# Altium project DC2019_Main_PCB.PrjPCB (part 1 of 2)
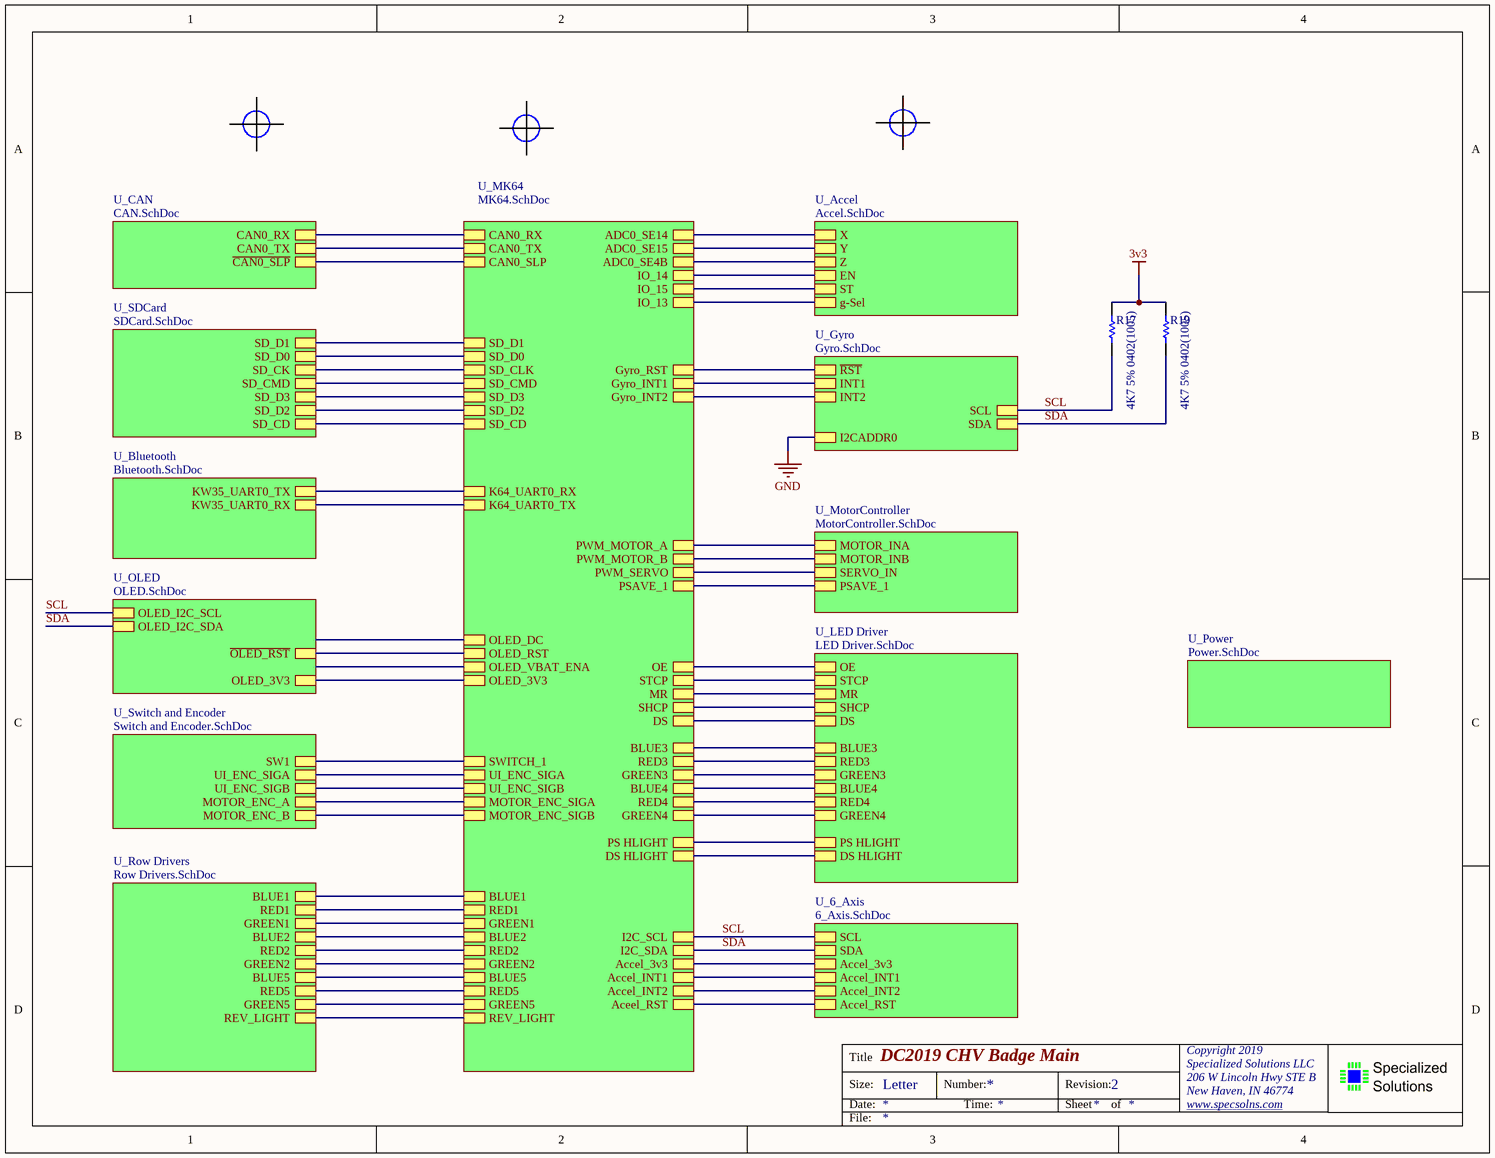
[diagram p0: Main.SchDoc]
projecttitle: DC2019 CHV Badge Main; projectrevision: 2
19 sheets, 179 parts. Net scope: hierarchical (ports join the sheet entries above them; power ports are global).
Board file: Main PCB.PcbDoc
Sheets:
  Main.SchDoc
    U_Gyro = Gyro.SchDoc
    U_MotorController = MotorController.SchDoc
    U_OLED = OLED.SchDoc
    U_SDCard = SDCard.SchDoc
    U_CAN = CAN.SchDoc
    U_Bluetooth = Bluetooth.SchDoc
    U_LED Driver = LED Driver.SchDoc
      595andMun = 595andMun.SchDoc
      U_20p Connector = 20p Connector.SchDoc
      U_Main Board RGB = Main Board RGB.SchDoc
        RGB and TurnS = RGB and TurnS.SchDoc
        RGB and TurnS = RGB and TurnS.SchDoc
    U_MK64 = MK64.SchDoc
      U_MK64 Power ADC = MK64 Power ADC.SchDoc
    U_Accel = Accel.SchDoc
    U_Switch and Encoder = Switch and Encoder.SchDoc
    U_Power = Power.SchDoc
    U_Row Drivers = Row Drivers.SchDoc
    U_6_Axis = 6_Axis.SchDoc

## Sheet Main.SchDoc
size Letter

### Parts
(Parts that share a designator on the sheet are numbered #1, #2 ... from top to bottom, then left to right.)
?#1  Fiducial (Cross)  [Fiducial - Cross]  (value not drawn)  (no BOM)
?#2  Fiducial (Cross)  [Fiducial - Cross]  (value not drawn)  (no BOM)
?#3  Fiducial (Cross)  [Fiducial - Cross]  (value not drawn)  (no BOM)
R17  4K7 5% 0402(1005)  [RESC0402(1005)_L]
R19  4K7 5% 0402(1005)  [RESC0402(1005)_L]

### Sub-sheets
U_6_Axis = 6_Axis.SchDoc: Accel_3v3, SCL, SDA, Accel_INT1, Accel_INT2, Accel_RST
U_Accel = Accel.SchDoc: g-Sel, X, Y, Z, EN, ST
U_Bluetooth = Bluetooth.SchDoc: KW35_UART0_RX, KW35_UART0_TX
U_CAN = CAN.SchDoc: ~{CAN0_SLP}, CAN0_TX, CAN0_RX
U_Gyro = Gyro.SchDoc: ~{RST}, INT1, INT2, SCL, SDA, I2CADDR0
U_LED Driver = LED Driver.SchDoc: OE, STCP, MR, SHCP, DS, BLUE3, RED3, GREEN3, BLUE4, RED4, GREEN4, PS HLIGHT, DS HLIGHT
U_MK64 = MK64.SchDoc: CAN0_RX, CAN0_TX, CAN0_SLP, SD_D1, SD_D0, SD_CLK, SD_CMD, SD_D3, SD_D2, SD_CD, OLED_RST, OLED_DC, OLED_VBAT_ENA, OLED_3V3, I2C_SDA, I2C_SCL, Gyro_RST, Gyro_INT1, Gyro_INT2, PWM_MOTOR_A, PWM_MOTOR_B, PWM_SERVO, UI_ENC_SIGA, UI_ENC_SIGB, MOTOR_ENC_SIGA, MOTOR_ENC_SIGB, IO_13, IO_15, IO_14, OE, STCP, MR, SHCP, DS, RED1, GREEN1, BLUE1, BLUE3, RED2, BLUE2, GREEN3, RED3, GREEN2, GREEN4, RED4, BLUE4, PSAVE_1, SWITCH_1, PS HLIGHT, DS HLIGHT, K64_UART0_TX, K64_UART0_RX, ADC0_SE14, ADC0_SE15, ADC0_SE4B, BLUE5, RED5, GREEN5, REV_LIGHT, Aceel_RST, Accel_INT2, Accel_3v3, Accel_INT1
U_MotorController = MotorController.SchDoc: MOTOR_INA, MOTOR_INB, SERVO_IN, PSAVE_1
U_OLED = OLED.SchDoc: OLED_I2C_SCL, OLED_I2C_SDA, ~{OLED_RST}, OLED_3V3
U_Power = Power.SchDoc: no entries
U_Row Drivers = Row Drivers.SchDoc: BLUE1, RED1, GREEN1, BLUE2, RED2, GREEN2, REV_LIGHT, RED5, BLUE5, GREEN5
U_SDCard = SDCard.SchDoc: SD_D2, SD_D3, SD_CK, SD_D1, SD_D0, SD_CMD, SD_CD
U_Switch and Encoder = Switch and Encoder.SchDoc: UI_ENC_SIGA, UI_ENC_SIGB, MOTOR_ENC_A, MOTOR_ENC_B, SW1

### Nets
3v3: R17.2 R19.2
Accel_3v3: sheet U_MK64/Accel_3v3, sheet U_6_Axis/Accel_3v3
INT1: sheet U_MK64/Accel_INT1, sheet U_6_Axis/Accel_INT1
INT2: sheet U_MK64/Accel_INT2, sheet U_6_Axis/Accel_INT2
OLED_3V3: sheet U_OLED/OLED_3V3, sheet U_MK64/OLED_3V3
RST: sheet U_MK64/Aceel_RST, sheet U_6_Axis/Accel_RST
SCL: R17.1 ; sheet U_Gyro/SCL, sheet U_OLED/OLED_I2C_SCL, sheet U_MK64/I2C_SCL, sheet U_6_Axis/SCL
SDA: R19.1 ; sheet U_Gyro/SDA, sheet U_OLED/OLED_I2C_SDA, sheet U_MK64/I2C_SDA, sheet U_6_Axis/SDA
SW1: sheet U_MK64/SWITCH_1, sheet U_Switch and Encoder/SW1
UI_ENC_SIGA: sheet U_MK64/UI_ENC_SIGA, sheet U_Switch and Encoder/UI_ENC_SIGA
UI_ENC_SIGB: sheet U_MK64/UI_ENC_SIGB, sheet U_Switch and Encoder/UI_ENC_SIGB
NetC3_2: sheet U_MK64/ADC0_SE15, sheet U_Accel/Y
NetC4_2: sheet U_MK64/ADC0_SE14, sheet U_Accel/X
NetC5_2: sheet U_MK64/ADC0_SE4B, sheet U_Accel/Z
NetP7_1: sheet U_SDCard/SD_D2, sheet U_MK64/SD_D2
NetP7_2: sheet U_SDCard/SD_D3, sheet U_MK64/SD_D3
NetP7_3: sheet U_SDCard/SD_CMD, sheet U_MK64/SD_CMD
NetP7_7: sheet U_SDCard/SD_D0, sheet U_MK64/SD_D0
NetP7_8: sheet U_SDCard/SD_D1, sheet U_MK64/SD_D1
NetP7_9: sheet U_SDCard/SD_CD, sheet U_MK64/SD_CD
NetQ2_2: sheet U_MK64/RED1, sheet U_Row Drivers/RED1
NetQ2_5: sheet U_MK64/BLUE1, sheet U_Row Drivers/BLUE1
NetQ3_2: sheet U_LED Driver/RED4, sheet U_MK64/RED4
NetQ3_5: sheet U_LED Driver/BLUE4, sheet U_MK64/BLUE4
NetQ4_2: sheet U_MK64/RED5, sheet U_Row Drivers/RED5
NetQ4_5: sheet U_MK64/GREEN1, sheet U_Row Drivers/GREEN1
NetQ5_2: sheet U_LED Driver/DS HLIGHT, sheet U_MK64/DS HLIGHT
NetQ5_5: sheet U_LED Driver/GREEN4, sheet U_MK64/GREEN4
NetQ10_2: sheet U_MK64/REV_LIGHT, sheet U_Row Drivers/REV_LIGHT
NetQ10_5: sheet U_MK64/GREEN5, sheet U_Row Drivers/GREEN5
NetQ11_2: sheet U_MK64/GREEN2, sheet U_Row Drivers/GREEN2
NetQ11_5: sheet U_MK64/RED2, sheet U_Row Drivers/RED2
NetQ12_2: sheet U_LED Driver/RED3, sheet U_MK64/RED3
NetQ12_5: sheet U_LED Driver/BLUE3, sheet U_MK64/BLUE3
NetQ13_2: sheet U_LED Driver/PS HLIGHT, sheet U_MK64/PS HLIGHT
NetQ13_5: sheet U_LED Driver/GREEN3, sheet U_MK64/GREEN3
NetQ14_2: sheet U_MK64/BLUE5, sheet U_Row Drivers/BLUE5
NetQ14_5: sheet U_MK64/BLUE2, sheet U_Row Drivers/BLUE2
NetR13_1: sheet U_SDCard/SD_CK, sheet U_MK64/SD_CLK
NetSW1_1: sheet U_MK64/MOTOR_ENC_SIGB, sheet U_Switch and Encoder/MOTOR_ENC_B
NetSW1_2: sheet U_MK64/MOTOR_ENC_SIGA, sheet U_Switch and Encoder/MOTOR_ENC_A
NetU1_10: sheet U_LED Driver/MR, sheet U_MK64/MR
NetU1_11: sheet U_LED Driver/SHCP, sheet U_MK64/SHCP
NetU1_12: sheet U_LED Driver/STCP, sheet U_MK64/STCP
NetU1_13: sheet U_LED Driver/OE, sheet U_MK64/OE
NetU1_14: sheet U_LED Driver/DS, sheet U_MK64/DS
NetU2_1: sheet U_MotorController/MOTOR_INA, sheet U_MK64/PWM_MOTOR_A
NetU2_2: sheet U_MotorController/MOTOR_INB, sheet U_MK64/PWM_MOTOR_B
NetU2_12: sheet U_MotorController/SERVO_IN, sheet U_MK64/PWM_SERVO
NetU2_13: sheet U_MotorController/PSAVE_1, sheet U_MK64/PSAVE_1
NetU3_3: sheet U_MK64/IO_15, sheet U_Accel/ST
NetU3_4: sheet U_MK64/IO_14, sheet U_Accel/EN
NetU3_5: sheet U_MK64/IO_13, sheet U_Accel/g-Sel
NetU4_46: sheet U_Bluetooth/KW35_UART0_RX, sheet U_MK64/K64_UART0_TX
NetU4_47: sheet U_Bluetooth/KW35_UART0_TX, sheet U_MK64/K64_UART0_RX
NetU5_85: sheet U_Gyro/~{RST}, sheet U_MK64/Gyro_RST
NetU5_86: sheet U_Gyro/INT1, sheet U_MK64/Gyro_INT1
NetU5_87: sheet U_Gyro/INT2, sheet U_MK64/Gyro_INT2
NetU5_89: sheet U_OLED/~{OLED_RST}, sheet U_MK64/OLED_RST
NetU5_97: sheet U_CAN/CAN0_TX, sheet U_MK64/CAN0_TX
NetU5_98: sheet U_CAN/CAN0_RX, sheet U_MK64/CAN0_RX
NetU5_99: sheet U_CAN/~{CAN0_SLP}, sheet U_MK64/CAN0_SLP

Not connected (* = marked no-connect by the designer): ?#1 0; ?#2 0; ?#3 0

### Notes on the sheet
- Title
- Size:
- Date:
- Letter
- Number:
- Time:
- Revision:
- Sheet
- of
- Copyright 2019
- Specialized Solutions LLC
- 206 W Lincoln Hwy STE B
- New Haven, IN 46774
- www.specsolns.com <http://www.specsolns.com>
- File:

### Library data of the parts
?#1-?#3 = Fiducial - Cross
R17 R19 = CMP-1011-00090-1: 4K7 0.063W 5% 0402 (1005 Metric)  SMD; Value: 4700.00 Ohm; Case-EIA: 0402; Case-Metric: 1005; Tolerance: 5 %; Power: 0.063 W; Technology: SMT

## Sheet Gyro.SchDoc
size Letter; Organization: Altium Limited; Address1: L3, 12a Rodborough Rd; Address2: Frenchs Forest; Address3: NSW; Address4: Australia 2086
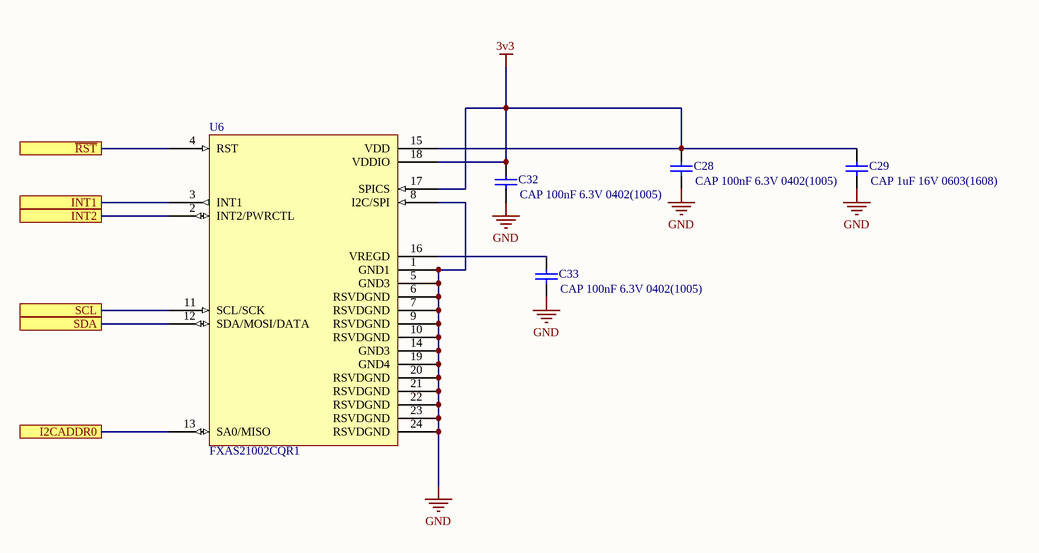
[diagram p1: Gyro.SchDoc]

### Parts
C28  CAP 100nF 6.3V 0402(1005)  [CAPC0402(1005)60_M]
C29  CAP 1uF 16V 0603(1608)  [CAPC0603(1608)100_L]
C32  CAP 100nF 6.3V 0402(1005)  [CAPC0402(1005)60_M]
C33  CAP 100nF 6.3V 0402(1005)  [CAPC0402(1005)60_M]
U6  FXAS21002CQR1  [QFN50P400X400X105-24N]

### Ports
I2CADDR0, INT1, INT2, SCL, SDA, ~{RST}

### Nets
3v3: C28.2 C29.2 C32.2 U6.15(VDD) U6.17(SPICS) U6.18(VDDIO)
GND: C28.1 C29.1 C32.1 C33.1 U6.1(GND1) U6.5(GND3) U6.6(RSVDGND) U6.7(RSVDGND) U6.8(I2C/SPI) U6.9(RSVDGND) U6.10(RSVDGND) U6.13(SA0/MISO) U6.14(GND3) U6.19(GND4) U6.20(RSVDGND) U6.21(RSVDGND) U6.22(RSVDGND) U6.23(RSVDGND) U6.24(RSVDGND) ; port I2CADDR0
SCL: U6.11(SCL/SCK) ; port SCL
SDA: U6.12(SDA/MOSI/DATA) ; port SDA
NetC33_2: C33.2 U6.16(VREGD)
NetU5_85: U6.4(RST) ; port ~{RST}
NetU5_86: U6.3(INT1) ; port INT1
NetU5_87: U6.2(INT2/PWRCTL) ; port INT2

### Notes on the sheet
- Title
- Size:
- Date:
- Letter
- Number:
- Time:
- Revision:
- Sheet
- of
- Copyright 2019
- Specialized Solutions LLC
- 206 W Lincoln Hwy STE B
- New Haven, IN 46774
- www.specsolns.com <http://www.specsolns.com>
- File:

### Library data of the parts
C28 C32 C33 = CMP-1034-02062-1: CAP 100nF 6.3V ±20% 0402 (1005 Metric) Thickness 0.6mm SMD; Case-EIA: 0402; Tolerance: Â±20%; Case-Metric: 1005; Value: 100nF; Technology: SMT; Max Thickness: 0.6 mm; Rated Voltage: 6.3 V
C29 = CMP-1035-02738-1: CAP 1uF 16V ±20% 0603 (1608 Metric) Thickness 1mm SMD; Case-Metric: 1608; Case-EIA: 0603; Tolerance: Â±20%; Value: 1uF; Rated Voltage: 16 V; Max Thickness: 1 mm; Technology: SMT
U6 = FXAS21002CQR1: 3-Axis Digital Angular Rate / Gyroscope

## Sheet MotorController.SchDoc
size Letter
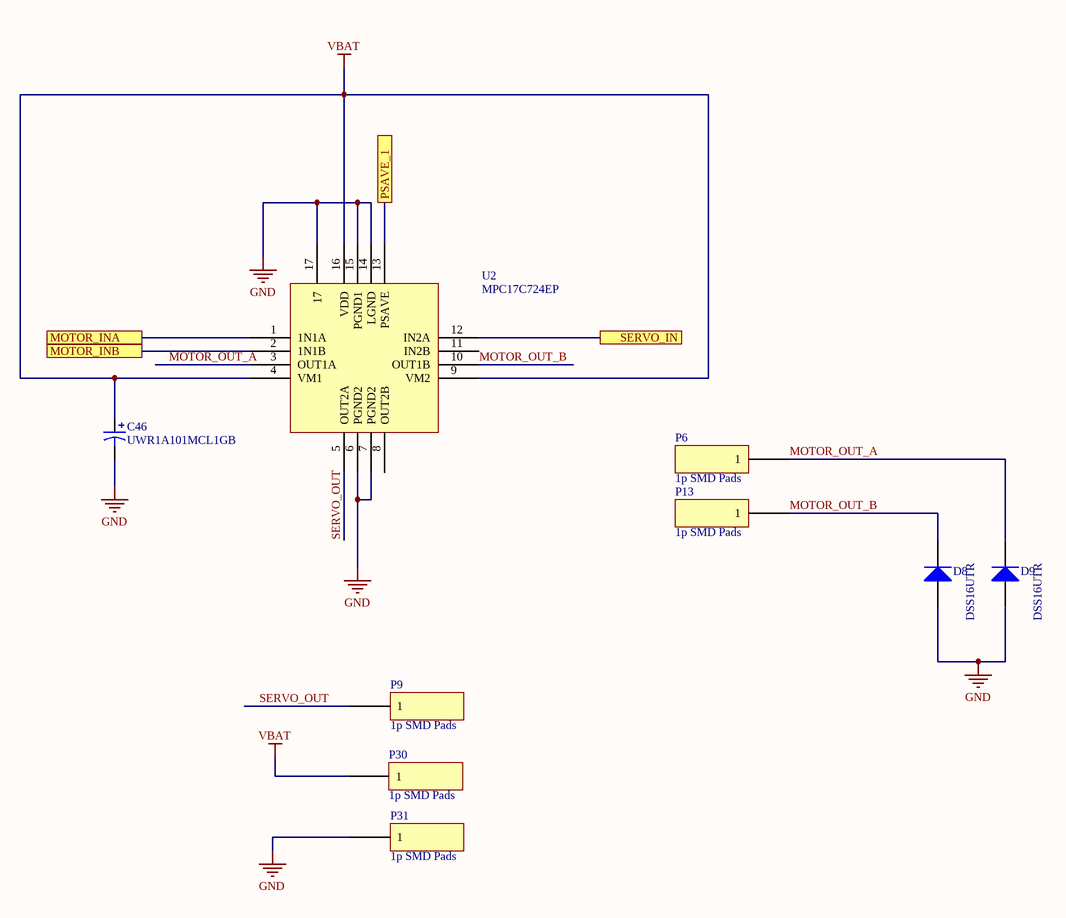
[diagram p2: MotorController.SchDoc]

### Parts
C46  UWR1A101MCL1GB  [UWR1A101MCL1GB]
D8  DSS16UTR  [MCC-SOD-123FL_V]
D9  DSS16UTR  [MCC-SOD-123FL_V]
P6  1p SMD Pads  [1p SMD pad]
P9  1p SMD Pads  [1p SMD pad]
P13  1p SMD Pads  [1p SMD pad]
P30  1p SMD Pads  [1p SMD pad]
P31  1p SMD Pads  [1p SMD pad]
U2  MPC17C724EP  [QFN50P300X300X85_HS-17N]

### Ports
MOTOR_INA, MOTOR_INB, PSAVE_1, SERVO_IN

### Nets
GND: C46.2 D8.1(A) D9.1(A) P31.1 U2.6(PGND2) U2.7(PGND2) U2.14(LGND) U2.15(PGND1) U2.17
VBAT: C46.1 P30.1 U2.4(VM1) U2.9(VM2) U2.16(VDD)
MOTOR_OUT_A: D9.2(K) P6.1 U2.3(OUT1A)
MOTOR_OUT_B: D8.2(K) P13.1 U2.10(OUT1B)
SERVO_OUT: P9.1 U2.5(OUT2A)
NetU2_1: U2.1(1N1A) ; port MOTOR_INA
NetU2_2: U2.2(1N1B) ; port MOTOR_INB
NetU2_12: U2.12(IN2A) ; port SERVO_IN
NetU2_13: U2.13(PSAVE) ; port PSAVE_1

Not connected (* = marked no-connect by the designer): U2 8(OUT2B) 11(IN2B)

### Notes on the sheet
- Title
- Size:
- Date:
- Letter
- Number:
- Time:
- Revision:
- Sheet
- of
- Copyright 2019
- Specialized Solutions LLC
- 206 W Lincoln Hwy STE B
- New Haven, IN 46774
- www.specsolns.com <http://www.specsolns.com>
- File:

### Library data of the parts
C46 = UWR1A101MCL1GB: 100uF Electrolytic
D8 = CMP-2000-07084-1: SCHOTTKY 60V SOD-123FL; Manufacturer: Micro Commercial Components; Diode Configuration: Single; Diode Type: StandardRecovery; Forward Surge Current Ifsm Max: 30A; Forward Current If(AV): 1A; Forward Voltage VF Max: 1.1V; Repetitive Reverse Voltage Vrrm Max: 1kV; Manufacturer URL: http://www.mccsemi.com/; Datasheet URL: http://www.mccsemi.com/up_pdf/SM4001PL-SM4007PL(SOD-123FL).PDF; Package Description: 2-Pin Small Outline Diode, Flat Lead, Body 2.825 x 1.65 mm; Datasheet Version: Rev. H, 05/2015; Package Reference: SOD-123FL; Mounting Technology: SurfaceMount
D9 = CMP-2000-07084-1: SCHOTTKY 60V SOD-123FL Reel; Manufacturer: Micro Commercial Components; Diode Configuration: Single; Diode Type: StandardRecovery; Forward Surge Current Ifsm Max: 30A; Forward Current If(AV): 1A; Forward Voltage VF Max: 1.1V; Repetitive Reverse Voltage Vrrm Max: 1kV; Manufacturer URL: http://www.mccsemi.com/; Datasheet URL: http://www.mccsemi.com/up_pdf/SM4001PL-SM4007PL(SOD-123FL).PDF; Package Description: 2-Pin Small Outline Diode, Flat Lead, Body 2.825 x 1.65 mm; Datasheet Version: Rev. H, 05/2015; Package Reference: SOD-123FL; Mounting Technology: SurfaceMount
P6 P9 P13 P30 P31 = 1p SMD
U2 = MPC17C724EP: 0.4 A Dual H-Bridge Motor Driver

## Sheet OLED.SchDoc
size Letter
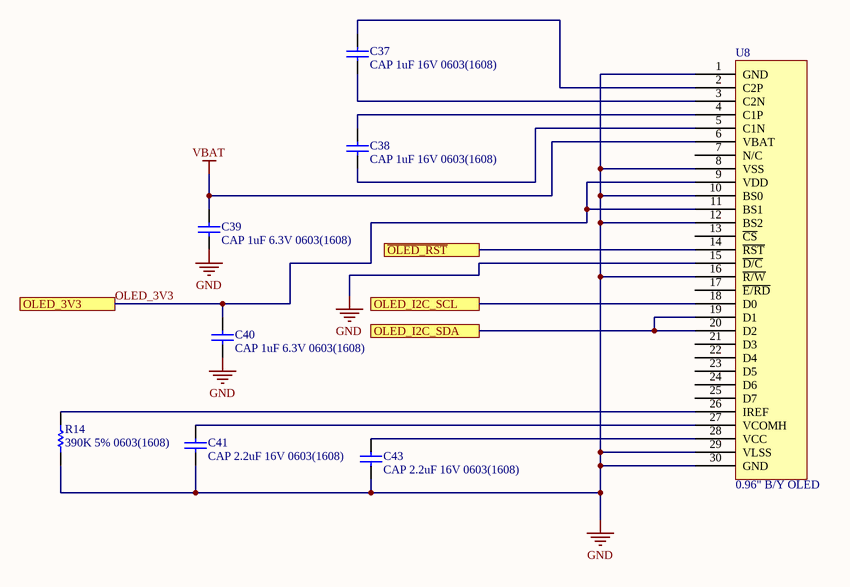
[diagram p3: OLED.SchDoc]

### Parts
C37  CAP 1uF 16V 0603(1608)  [CAPC0603(1608)100_L]
C38  CAP 1uF 16V 0603(1608)  [CAPC0603(1608)100_L]
C39  CAP 1uF 6.3V 0603(1608)  [CAPC0603(1608)100_L]
C40  CAP 1uF 6.3V 0603(1608)  [CAPC0603(1608)100_L]
C41  CAP 2.2uF 16V 0603(1608)  [CAPC0603(1608)55_L]
C43  CAP 2.2uF 16V 0603(1608)  [CAPC0603(1608)55_L]
R14  390K 5% 0603(1608)  [RESC0603(1608)_N]
U8  0.96" B/Y OLED  [0.96" B/Y OLED]

### Ports
OLED_3V3, OLED_I2C_SCL, OLED_I2C_SDA, ~{OLED_RST}

### Nets
GND: C39.1 C40.1 C41.1 C43.1 R14.1 U8.1(GND) U8.8(VSS) U8.10(BS0) U8.12(BS2) U8.15(~{D/C}) U8.16(~{R/W}) U8.29(VLSS) U8.30(GND)
VBAT: C39.2 U8.6(VBAT)
OLED_3V3: C40.2 U8.9(VDD) U8.11(BS1) ; port OLED_3V3
SCL: U8.18(D0) ; port OLED_I2C_SCL
SDA: U8.19(D1) U8.20(D2) ; port OLED_I2C_SDA
NetC37_1: C37.1 U8.3(C2N)
NetC37_2: C37.2 U8.2(C2P)
NetC38_1: C38.1 U8.5(C1N)
NetC38_2: C38.2 U8.4(C1P)
NetC41_2: C41.2 U8.27(VCOMH)
NetC43_2: C43.2 U8.28(VCC)
NetR14_2: R14.2 U8.26(IREF)
NetU5_89: U8.14(~{RST}) ; port ~{OLED_RST}

Not connected (* = marked no-connect by the designer): U8 7(N/C) 13(~{CS}) 17(~{E/RD}) 21(D3) 22(D4) 23(D5) 24(D6) 25(D7)

### Notes on the sheet
- Title
- Size:
- Date:
- Letter
- Number:
- Time:
- Revision:
- Sheet
- of
- Copyright 2019
- Specialized Solutions LLC
- 206 W Lincoln Hwy STE B
- New Haven, IN 46774
- www.specsolns.com <http://www.specsolns.com>
- File:

### Library data of the parts
C37 C38 = CMP-1035-02738-1: as C29 on sheet Gyro; Value: 1uF; Rated Voltage: 16 V; Max Thickness: 1 mm; Technology: SMT
C39 C40 = CMP-1035-02731-1: CAP 1uF 6.3V ±20% 0603 (1608 Metric) Thickness 1mm SMD; Case-EIA: 0603; Tolerance: Â±20%; Case-Metric: 1608; Value: 1uF; Technology: SMT; Max Thickness: 1 mm; Rated Voltage: 6.3 V
C41 C43 = CMP-1035-02764-1: CAP 2.2uF 16V ±20% 0603 (1608 Metric) Thickness 0.55mm SMD; Tolerance: Â±20%; Case-Metric: 1608; Case-EIA: 0603; Value: 2.2uF; Rated Voltage: 16 V; Max Thickness: 0.55 mm; Technology: SMT
R14 = CMP-1012-00136-1: 390K 0.1W 5% 0603 (1608 Metric)  SMD; Case-Metric: 1608; Case-EIA: 0603; Value: 390000.00 Ohm; Power: 0.1 W; Tolerance: 5 %; Technology: SMT
U8 = 0.96" B/Y OLED: 0.96" Blue/Yellow OLED 128x64 SSD1306

## Sheet SDCard.SchDoc
size Letter
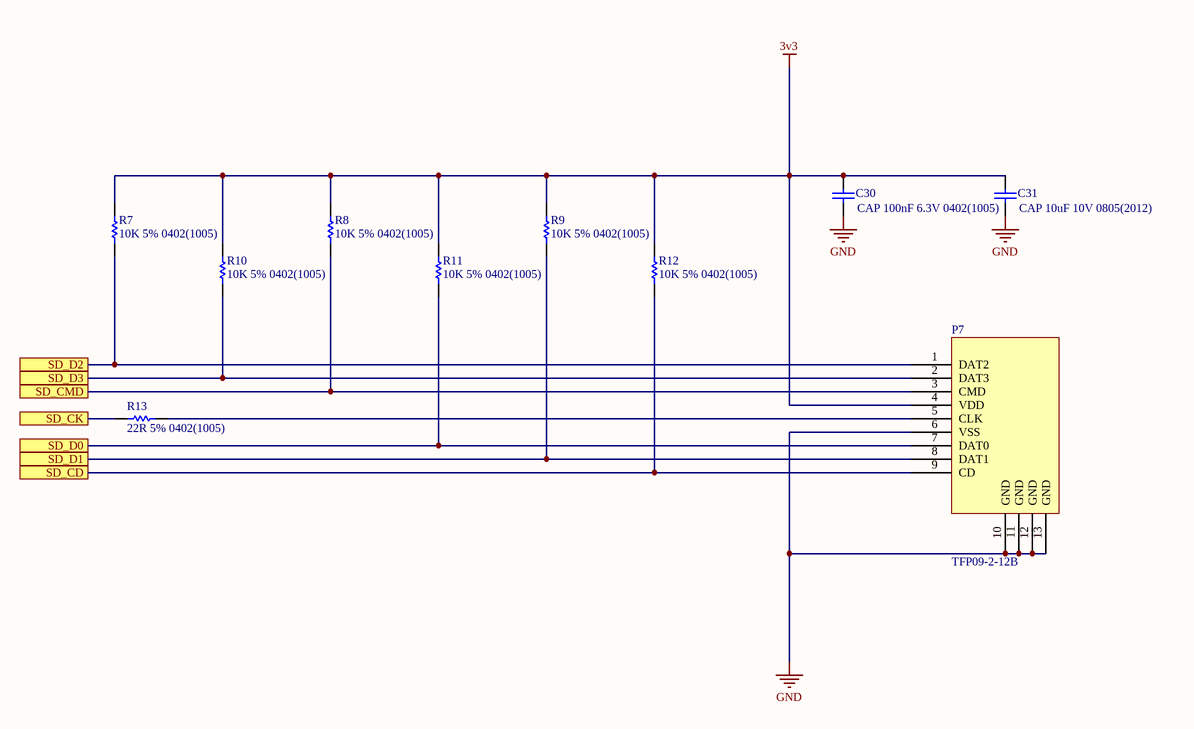
[diagram p4: SDCard.SchDoc]

### Parts
C30  CAP 100nF 6.3V 0402(1005)  [CAPC0402(1005)60_M]
C31  CAP 10uF 10V 0805(2012)  [CAPC0805(2012)100_N]
P7  TFP09-2-12B  [TFP09-2-12B]
R7  10K 5% 0402(1005)  [RESC0402(1005)_N]
R8  10K 5% 0402(1005)  [RESC0402(1005)_N]
R9  10K 5% 0402(1005)  [RESC0402(1005)_N]
R10  10K 5% 0402(1005)  [RESC0402(1005)_N]
R11  10K 5% 0402(1005)  [RESC0402(1005)_N]
R12  10K 5% 0402(1005)  [RESC0402(1005)_N]
R13  22R 5% 0402(1005)  [RESC0402(1005)_M]

### Ports
SD_CD, SD_CK, SD_CMD, SD_D0, SD_D1, SD_D2, SD_D3

### Nets
3v3: C30.2 C31.2 P7.4(VDD) R7.2 R8.2 R9.2 R10.2 R11.2 R12.2
GND: C30.1 C31.1 P7.6(VSS) P7.10(GND) P7.11(GND) P7.12(GND) P7.13(GND)
NetP7_1: P7.1(DAT2) R7.1 ; port SD_D2
NetP7_2: P7.2(DAT3) R10.1 ; port SD_D3
NetP7_3: P7.3(CMD) R8.1 ; port SD_CMD
NetP7_5: P7.5(CLK) R13.2
NetP7_7: P7.7(DAT0) R11.1 ; port SD_D0
NetP7_8: P7.8(DAT1) R9.1 ; port SD_D1
NetP7_9: P7.9(CD) R12.1 ; port SD_CD
NetR13_1: R13.1 ; port SD_CK

### Notes on the sheet
- Title
- Size:
- Date:
- Letter
- Number:
- Time:
- Revision:
- Sheet
- of
- Copyright 2019
- Specialized Solutions LLC
- 206 W Lincoln Hwy STE B
- New Haven, IN 46774
- www.specsolns.com <http://www.specsolns.com>
- File:

### Library data of the parts
C30 = CMP-1034-02062-1: as C28 on sheet Gyro; Value: 100nF; Technology: SMT; Max Thickness: 0.6 mm; Rated Voltage: 6.3 V
C31 = CMP-1036-04925-1: CAP 10uF 10V ±20% 0805 (2012 Metric) Thickness 1mm SMD; Case-Metric: 2012; Case-EIA: 0805; Tolerance: Â±20%; Technology: SMT; Max Thickness: 1 mm; Rated Voltage: 10 V; Value: 10uF
P7 = TFP09-2-12B: MicroSD Card Slot
R7-R12 = CMP-1011-00098-1: 10K 0.063W 5% 0402 (1005 Metric)  SMD; Case-Metric: 1005; Value: 10000.00 Ohm; Case-EIA: 0402; Technology: SMT; Tolerance: 5 %; Power: 0.063 W
R13 = CMP-1011-00034-1: 22R 0.063W 5% 0402 (1005 Metric)  SMD; Value: 22.00 Ohm; Case-EIA: 0402; Case-Metric: 1005; Power: 0.063 W; Tolerance: 5 %; Technology: SMT

## Sheet CAN.SchDoc
size Letter
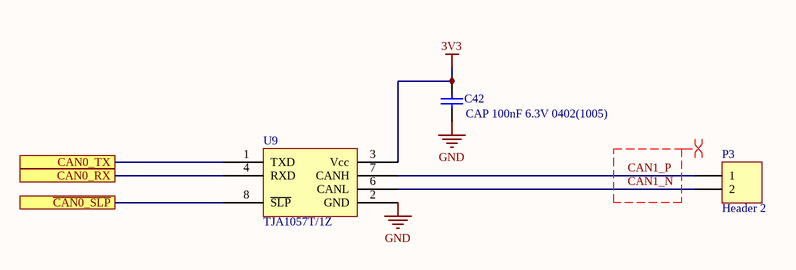
[diagram p5: CAN.SchDoc]

### Parts
C42  CAP 100nF 6.3V 0402(1005)  [CAPC0402(1005)60_M]
P3  Header 2  [HDR1X2]
U9  TJA1057T/1Z  [SOIC127P600X175-8N]

### Ports
CAN0_RX, CAN0_TX, ~{CAN0_SLP}

### Nets
3v3: C42.2 U9.3(Vcc)
GND: C42.1 U9.2(GND)
CAN1_N: P3.2 U9.6(CANL)
CAN1_P: P3.1 U9.7(CANH)
NetU5_97: U9.1(TXD) ; port CAN0_TX
NetU5_98: U9.4(RXD) ; port CAN0_RX
NetU5_99: U9.8(~{SLP}) ; port ~{CAN0_SLP}

### Layout directives
differential pair: CAN1_N, CAN1_P

### Notes on the sheet
- Title
- Size:
- Date:
- Letter
- Number:
- Time:
- Revision:
- Sheet
- of
- Copyright 2019
- Specialized Solutions LLC
- 206 W Lincoln Hwy STE B
- New Haven, IN 46774
- www.specsolns.com <http://www.specsolns.com>
- File:

### Library data of the parts
C42 = CMP-1034-02062-1: as C28 on sheet Gyro; Value: 100nF; Technology: SMT; Max Thickness: 0.6 mm; Rated Voltage: 6.3 V
P3 = Header 2: Header, 2-Pin; LatestRevisionDate: 17-Jul-2002; LatestRevisionNote: Re-released for DXP Platform.; Publisher: Altium Limited
U9 = TJA1057T/1Z: CAN-FD XVR 5v

## Sheet Bluetooth.SchDoc
size Letter
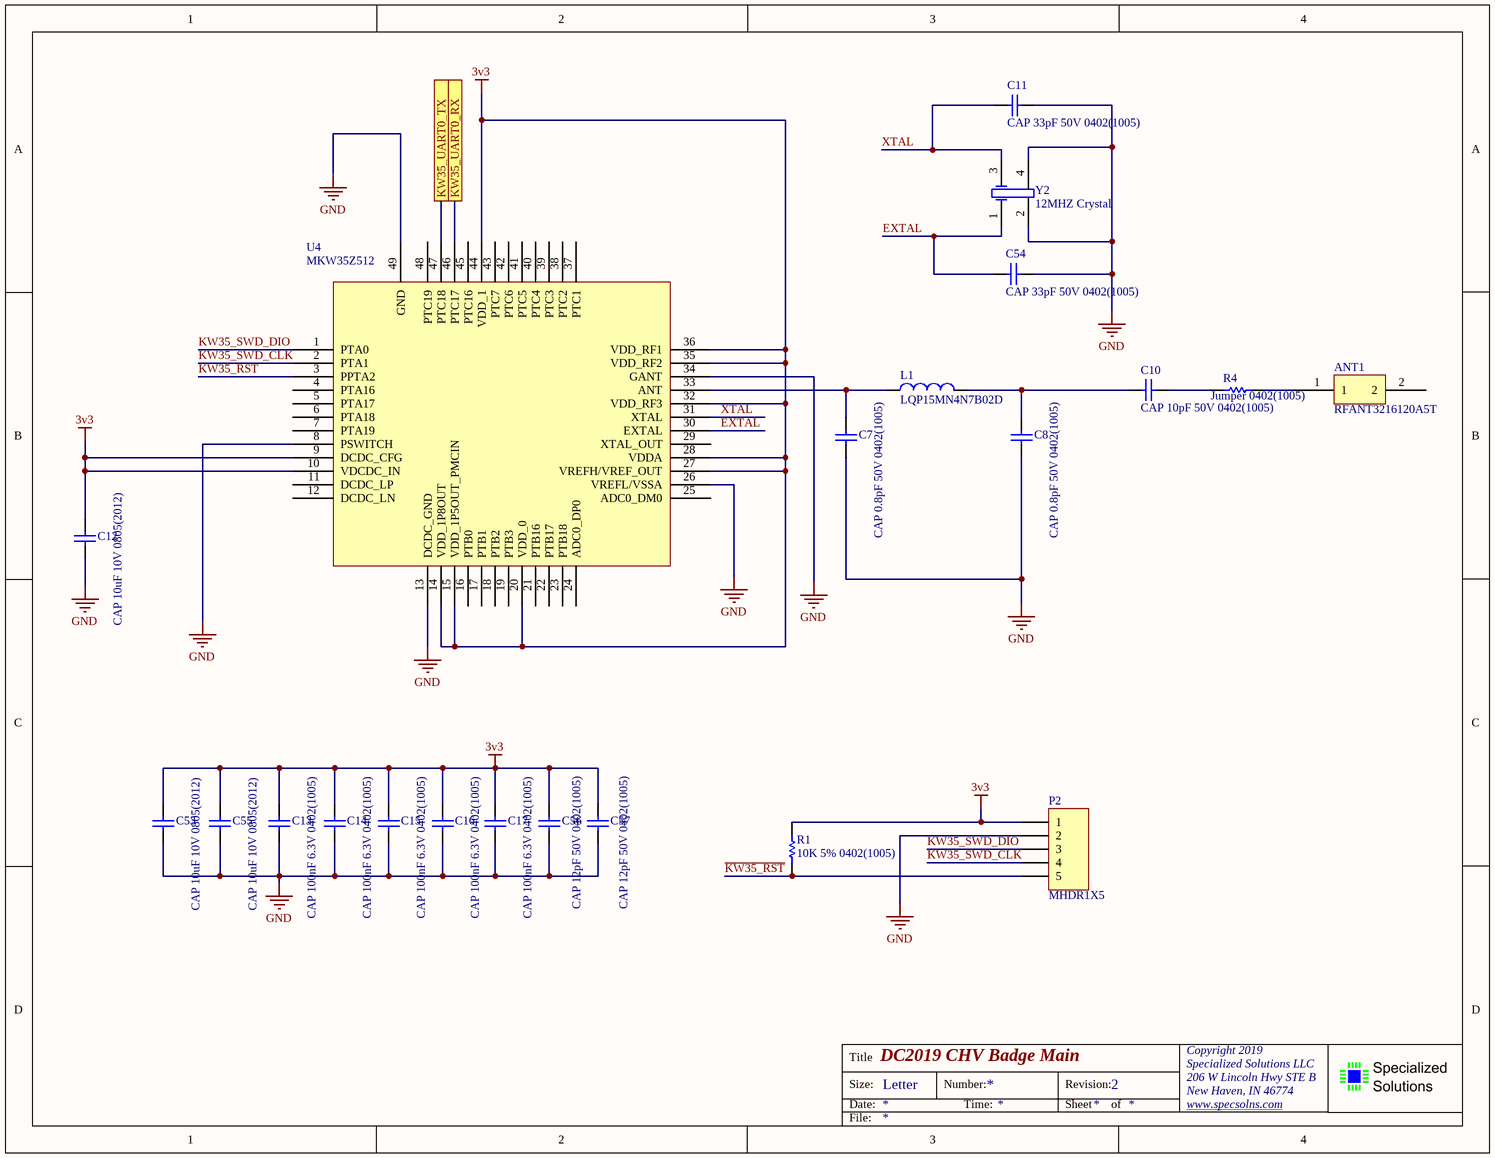
[diagram p6: Bluetooth.SchDoc]

### Parts
ANT1  RFANT3216120A5T  [RFANT3216120A5T]
C7  CAP 0.8pF 50V 0402(1005)  [CAPC0402(1005)60_N]
C8  CAP 0.8pF 50V 0402(1005)  [CAPC0402(1005)60_N]
C10  CAP 10pF 50V 0402(1005)  [CAPC0402(1005)60_L]
C11  CAP 33pF 50V 0402(1005)  [CAPC0402(1005)60_N]
C12  CAP 10uF 10V 0805(2012)  [CAPC0805(2012)145_N]
C13  CAP 100nF 6.3V 0402(1005)  [CAPC0402(1005)60_M]
C14  CAP 100nF 6.3V 0402(1005)  [CAPC0402(1005)60_M]
C15  CAP 100nF 6.3V 0402(1005)  [CAPC0402(1005)60_M]
C16  CAP 100nF 6.3V 0402(1005)  [CAPC0402(1005)60_M]
C17  CAP 100nF 6.3V 0402(1005)  [CAPC0402(1005)60_M]
C53  CAP 10uF 10V 0805(2012)  [CAPC0805(2012)145_N]
C54  CAP 33pF 50V 0402(1005)  [CAPC0402(1005)60_N]
C55  CAP 10uF 10V 0805(2012)  [CAPC0805(2012)145_N]
C56  CAP 12pF 50V 0402(1005)  [CAPC0402(1005)33_L]
C57  CAP 12pF 50V 0402(1005)  [CAPC0402(1005)33_L]
L1  LQP15MN4N7B02D  [INDC1005X45X25LL10T10]
P2  MHDR1X5  [MHDR1X5]
R1  10K 5% 0402(1005)  [RESC0402(1005)_N]
R4  Jumper 0402(1005)  [RESC0402(1005)_N]
U4  MKW35Z512  [VQFN64R]
Y2  12MHZ Crystal  [DFN155P250X80-4N]

### Ports
KW35_UART0_RX, KW35_UART0_TX

### Nets
3v3: C12.1 C13.2 C14.2 C15.2 C16.2 C17.2 C53.1 C55.1 C56.2 C57.2 P2.1 R1.2 U4.9(DCDC_CFG) U4.10(VDCDC_IN) U4.14(VDD_1P8OUT) U4.15(VDD_1P5OUT_PMCIN) U4.20(VDD_0) U4.27(VREFH/VREF_OUT) U4.28(VDDA) U4.32(VDD_RF3) U4.35(VDD_RF2) U4.36(VDD_RF1) U4.44(VDD_1)
GND: C7.1 C8.1 C11.2 C12.2 C13.1 C14.1 C15.1 C16.1 C17.1 C53.2 C54.2 C55.2 C56.1 C57.1 P2.2 U4.8(PSWITCH) U4.13(DCDC_GND) U4.26(VREFL/VSSA) U4.34(GANT) U4.49(GND) Y2.2(GND) Y2.4(GND)
~{KW35_RST}: P2.5 R1.1 U4.3(PPTA2)
EXTAL: C54.1 U4.30(EXTAL) Y2.1(OSC1)
KW35_SWD_CLK: P2.4 U4.2(PTA1)
KW35_SWD_DIO: P2.3 U4.1(PTA0)
XTAL: C11.1 U4.31(XTAL) Y2.3(OSC2)
NetANT1_1: ANT1.1 R4.2
NetC7_2: C7.2 L1.1 U4.33(ANT)
NetC8_2: C8.2 C10.1 L1.2
NetC10_2: C10.2 R4.1
NetU4_46: U4.46(PTC17) ; port KW35_UART0_RX
NetU4_47: U4.47(PTC18) ; port KW35_UART0_TX

Not connected (* = marked no-connect by the designer): ANT1 2; U4 4(PTA16) 5(PTA17) 6(PTA18) 7(PTA19) 11(DCDC_LP) 12(DCDC_LN) 16(PTB0) 17(PTB1) 18(PTB2) 19(PTB3) 21(PTB16) 22(PTB17) 23(PTB18) 24(ADC0_DP0) 25(ADC0_DM0) 29(XTAL_OUT) 37(PTC1) 38(PTC2) 39(PTC3) 40(PTC4) 41(PTC5) 42(PTC6) 43(PTC7) 45(PTC16) 48(PTC19)

### Notes on the sheet
- Title
- Size:
- Date:
- Letter
- Number:
- Time:
- Revision:
- Sheet
- of
- Copyright 2019
- Specialized Solutions LLC
- 206 W Lincoln Hwy STE B
- New Haven, IN 46774
- www.specsolns.com <http://www.specsolns.com>
- File:

### Library data of the parts
ANT1 = RFANT3216120A5T: RF ANT 2.4GHZ CHIP SOLDER SMD
C7 C8 = CMP-1034-00043-1: CAP 0.8pF 50V ±0.1pF 0402 (1005 Metric) Thickness 0.6mm SMD; Case-EIA: 0402; Case-Metric: 1005; Tolerance: Â±0.1pF; Max Thickness: 0.6 mm; Technology: SMT; Value: 0.8pF; Rated Voltage: 50 V
C10 = CMP-1034-00722-1: CAP 10pF 50V ±2% 0402 (1005 Metric) Thickness 0.6mm SMD; Tolerance: Â±2%; Case-Metric: 1005; Case-EIA: 0402; Technology: SMT; Value: 10pF; Max Thickness: 0.6 mm; Rated Voltage: 50 V
C11 C54 = CMP-1034-01004-1: CAP 33pF 50V ±5% 0402 (1005 Metric) Thickness 0.6mm SMD; Tolerance: Â±5%; Case-Metric: 1005; Case-EIA: 0402; Rated Voltage: 50 V; Value: 33pF; Technology: SMT; Max Thickness: 0.6 mm
C12 C53 C55 = CMP-1036-04924-1: CAP 10uF 10V ±20% 0805 (2012 Metric) Thickness 1.45mm SMD; Case-EIA: 0805; Case-Metric: 2012; Tolerance: Â±20%; Rated Voltage: 10 V; Max Thickness: 1.45 mm; Value: 10uF; Technology: SMT
C13-C17 = CMP-1034-02062-1: as C28 on sheet Gyro; Value: 100nF; Technology: SMT; Max Thickness: 0.6 mm; Rated Voltage: 6.3 V
C56 C57 = CMP-1034-00769-1: CAP 12pF 50V ±5% 0402 (1005 Metric) Thickness 0.33mm SMD; Tolerance: Â±5%; Case-EIA: 0402; Case-Metric: 1005; Rated Voltage: 50 V; Max Thickness: 0.33 mm; Value: 12pF; Technology: SMT
L1 = CMP-2000-06592-1: Chip Inductor, 4.7 nH, +/- 0.1 nH, 160 mA, -40 to 85 degC, 0402 (1005 Metric), RoHS, Tape and Reel; Manufacturer: Murata; Maximum DC Resistance: 600mOhm; Type: RFChip; Inductance: 4.7nH; Product Height: 0.45mm; Maximum DC Current: 160mA; Minimum Quality Factor: 13@500MHz; Rad Hard: No; Tolerance: 0.1nH; Product Depth: 0.6mm; Package Description: 2-Pin Surface Mount Device, Body 1 x 0.5 mm; Package Reference: 0402; Datasheet Version: 09/2010; Packaging: Tape&Reel; Manufacturer URL: http://www.murata.com/; Package/Case: 0402; Datasheet URL: http://search.murata.co.jp/Ceramy/image/img/PDF/ENG/L0075S0084LQP15M.pdf; Mounting Technology: SurfaceMount
P2 = MHDR1X5: Header, 5-Pin; LatestRevisionDate: 17-Jul-2002; LatestRevisionNote: Re-released for DXP Platform.; Publisher: Altium Limited
R1 = CMP-1011-00098-1: as R7 on sheet SDCard; Technology: SMT; Tolerance: 5 %; Power: 0.063 W
R4 = CMP-1011-00001-1: Jumper 0402 (1005 Metric); Tolerance: None; Case-Metric: 1005; Case-EIA: 0402; Value: 0.00 Ohm; Power: None; Technology: SMT
U4 = MKW36Z512: KINETIS W 32-BIT MCU ARM CORTEX- Bluetooth
Y2 = 403C11E16M00000: CRYSTAL 12.0000MHZ 20PF SMD 3.20x2.50; Published: 8-Jun-2000; LatestRevisionDate: 17-Jul-2002; LatestRevisionNote: Re-released for DXP Platform.; PackageReference: R38; Publisher: Altium Limited; PackageDescription: Crystal, Thru-Hole; 2 Leads; Body 3.1 x 8.2 mm (Dia.xH)

## Sheet LED Driver.SchDoc
size Letter; Organization: Altium Limited; Address1: L3, 12a Rodborough Rd; Address2: Frenchs Forest; Address3: NSW; Address4: Australia 2086
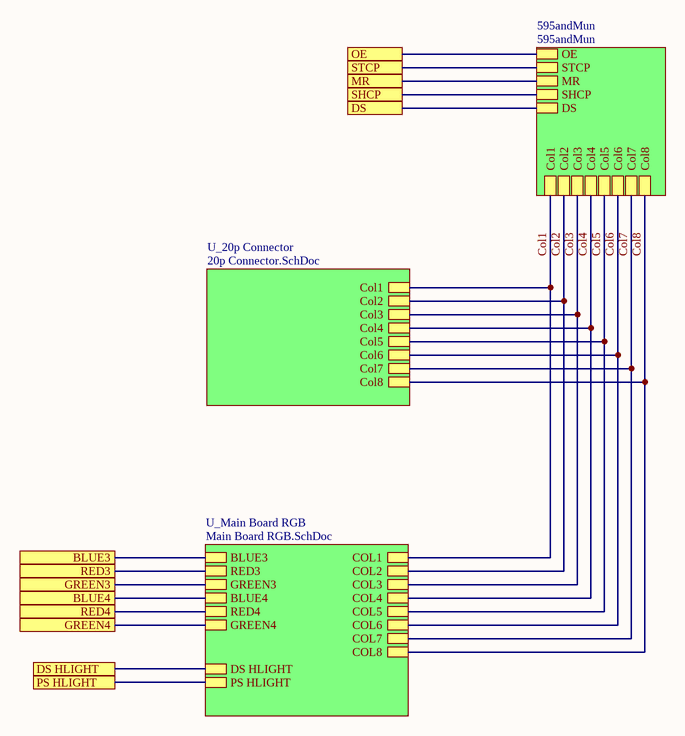
[diagram p7: LED Driver.SchDoc]

### Sub-sheets
595andMun = 595andMun: Col1, Col2, Col3, Col4, Col5, Col6, Col7, Col8, OE, STCP, MR, SHCP, DS
U_20p Connector = 20p Connector.SchDoc: Col1, Col3, Col2, Col4, Col5, Col8, Col6, Col7
U_Main Board RGB = Main Board RGB.SchDoc: BLUE3, RED3, GREEN3, BLUE4, RED4, GREEN4, COL1, COL2, COL3, COL4, COL5, COL6, COL7, COL8, DS HLIGHT, PS HLIGHT

### Ports
BLUE3, BLUE4, DS, DS HLIGHT, GREEN3, GREEN4, MR, OE, PS HLIGHT, RED3, RED4, SHCP, STCP

### Nets
Col1: sheet 595andMun/Col1, sheet U_20p Connector/Col1, sheet U_Main Board RGB/COL1
Col2: sheet 595andMun/Col2, sheet U_20p Connector/Col2, sheet U_Main Board RGB/COL2
Col3: sheet 595andMun/Col3, sheet U_20p Connector/Col3, sheet U_Main Board RGB/COL3
Col4: sheet 595andMun/Col4, sheet U_20p Connector/Col4, sheet U_Main Board RGB/COL4
Col5: sheet 595andMun/Col5, sheet U_20p Connector/Col5, sheet U_Main Board RGB/COL5
Col6: sheet 595andMun/Col6, sheet U_20p Connector/Col6, sheet U_Main Board RGB/COL6
Col7: sheet 595andMun/Col7, sheet U_20p Connector/Col7, sheet U_Main Board RGB/COL7
Col8: sheet 595andMun/Col8, sheet U_20p Connector/Col8, sheet U_Main Board RGB/COL8
NetQ3_2: port RED4, sheet U_Main Board RGB/RED4
NetQ3_5: port BLUE4, sheet U_Main Board RGB/BLUE4
NetQ5_2: port DS HLIGHT, sheet U_Main Board RGB/DS HLIGHT
NetQ5_5: port GREEN4, sheet U_Main Board RGB/GREEN4
NetQ12_2: port RED3, sheet U_Main Board RGB/RED3
NetQ12_5: port BLUE3, sheet U_Main Board RGB/BLUE3
NetQ13_2: port PS HLIGHT, sheet U_Main Board RGB/PS HLIGHT
NetQ13_5: port GREEN3, sheet U_Main Board RGB/GREEN3
NetU1_10: port MR, sheet 595andMun/MR
NetU1_11: port SHCP, sheet 595andMun/SHCP
NetU1_12: port STCP, sheet 595andMun/STCP
NetU1_13: port OE, sheet 595andMun/OE
NetU1_14: port DS, sheet 595andMun/DS

### Notes on the sheet
- Title
- Size:
- Date:
- Letter
- Number:
- Time:
- Revision:
- Sheet
- of
- Copyright 2019
- Specialized Solutions LLC
- 206 W Lincoln Hwy STE B
- New Haven, IN 46774
- www.specsolns.com <http://www.specsolns.com>
- File:

## Sheet 595andMun.SchDoc
size Letter; Organization: Altium Limited; Address1: L3, 12a Rodborough Rd; Address2: Frenchs Forest; Address3: NSW; Address4: Australia 2086
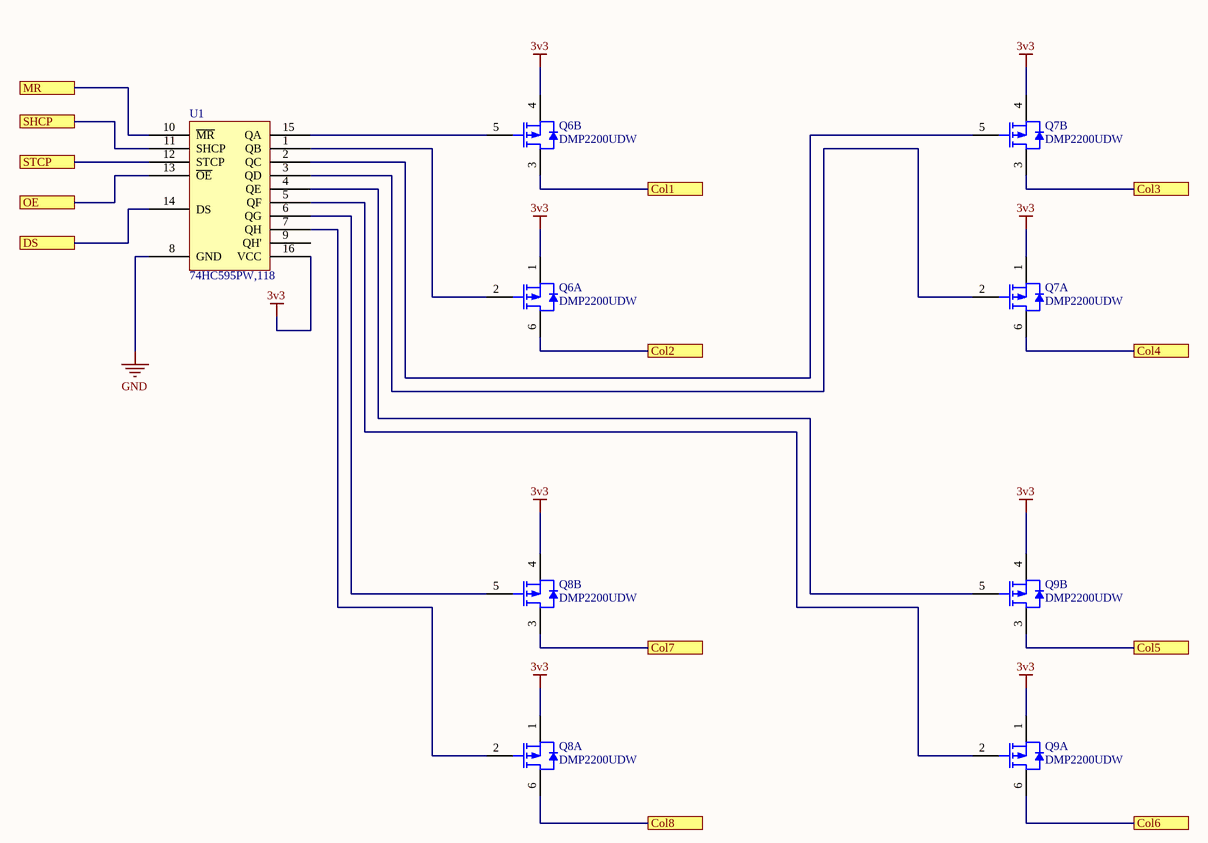
[diagram p8: 595andMun.SchDoc]

### Parts
Q6  DMP2200UDW  [DIOD-SOT363-6_V]  (parts A,B of 2)
Q7  DMP2200UDW  [DIOD-SOT363-6_V]  (parts A,B of 2)
Q8  DMP2200UDW  [DIOD-SOT363-6_V]  (parts A,B of 2)
Q9  DMP2200UDW  [DIOD-SOT363-6_V]  (parts A,B of 2)
U1  74HC595PW,118  [TSOP65P640X110-16N]

### Ports
Col1, Col2, Col3, Col4, Col5, Col6, Col7, Col8, DS, MR, OE, SHCP, STCP

### Nets
3v3: Q6.1(S) Q6.4(S) Q7.1(S) Q7.4(S) Q8.1(S) Q8.4(S) Q9.1(S) Q9.4(S) U1.16(VCC)
GND: U1.8(GND)
Col1: Q6.3(D) ; port Col1
Col2: Q6.6(D) ; port Col2
Col3: Q7.3(D) ; port Col3
Col4: Q7.6(D) ; port Col4
Col5: Q9.3(D) ; port Col5
Col6: Q9.6(D) ; port Col6
Col7: Q8.3(D) ; port Col7
Col8: Q8.6(D) ; port Col8
NetQ6_2: Q6.2(G) U1.1(QB)
NetQ6_5: Q6.5(G) U1.15(QA)
NetQ7_2: Q7.2(G) U1.3(QD)
NetQ7_5: Q7.5(G) U1.2(QC)
NetQ8_2: Q8.2(G) U1.7(QH)
NetQ8_5: Q8.5(G) U1.6(QG)
NetQ9_2: Q9.2(G) U1.5(QF)
NetQ9_5: Q9.5(G) U1.4(QE)
NetU1_10: U1.10(~{MR}) ; port MR
NetU1_11: U1.11(SHCP) ; port SHCP
NetU1_12: U1.12(STCP) ; port STCP
NetU1_13: U1.13(~{OE}) ; port OE
NetU1_14: U1.14(DS) ; port DS

Not connected (* = marked no-connect by the designer): U1 9(QH')

### Notes on the sheet
- Title
- Size:
- Date:
- Letter
- Number:
- Time:
- Revision:
- Sheet
- of
- Copyright 2019
- Specialized Solutions LLC
- 206 W Lincoln Hwy STE B
- New Haven, IN 46774
- www.specsolns.com <http://www.specsolns.com>
- File:

### Library data of the parts
Q6-Q9 = CMP-2000-05971-1: Dual P-Channel Enhancement Mode MOSFET, 50 VDS, -55 to 150 degC, 6-Pin SOT363, RoHS, Tape and Reel; Manufacturer: DiodesIncorporated; Vgs - Gate-Source Voltage: 20V; Typical Turn-On Delay Time: 10ns; Forward Transconductance - Min: 0.05S; Id - Continuous Drain Current: -130mA; Transistor Type: 2P-Channel; Typical Turn-Off Delay Time: 18ns; Unit Weight: 0.000212oz; Vds - Drain-Source Breakdown Voltage: -50V; Number of Channels: 2Channel; Pd - Power Dissipation: 300mW; Type: EnhancementModeFieldEffectTransistor; Rds On - Drain-Source Resistance: 6Ohms; Package Description: 6-Pin Small Outline Transistor, Body 1.25 x 2 mm, Pitch 0.65 mm; RoHS: True; Manufacturer URL: http://www.diodes.com/; Packaging: Reel; Series: BSS84; Mounting Style: SMD/SMT; Technology: Si; Height: 1mm; Configuration: Dual; Package Reference: SOT363-6; Length: 2.2mm; Mounting Technology: SurfaceMount; Factory Pack Quantity: 3000; Brand: DiodesIncorporated; Maximum Operating Temperature: +150C; Minimum Operating Temperature: -55C; Product Category: MOSFET; Datasheet URL: http://www.diodes.com/_files/datasheets/ds30204.pdf; Width: 1.35mm; Product: MOSFETSmallSignal; Channel Mode: Enhancement; Transistor Polarity: P-Channel; Datasheet Version: Rev. 18-2, 01/2014; Package / Case: SOT-363-6; PartId: 1
U1 = 74HC595PW,118: IC SHIFT REGISTER 8BIT 16TSSOP

## Sheet 20p Connector.SchDoc
size Letter
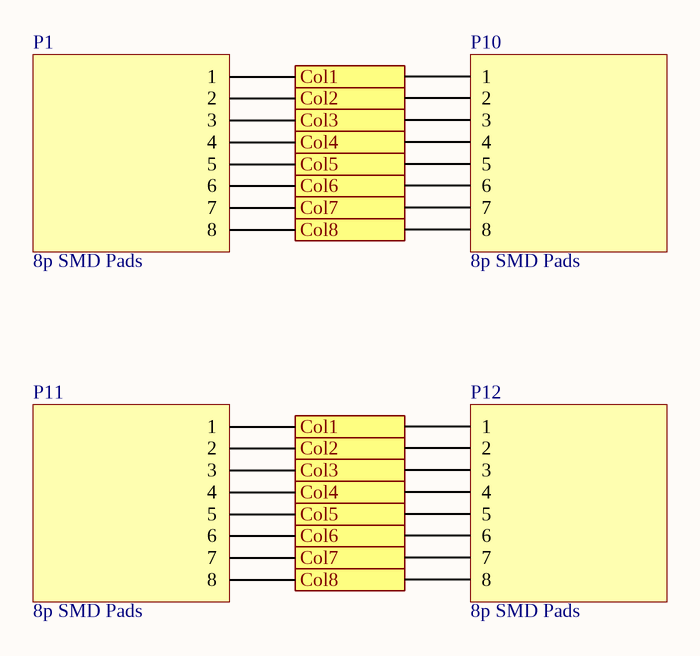
[diagram p9: 20p Connector.SchDoc]

### Parts
P1  8p SMD Pads  [8p SMD pad]
P10  8p SMD Pads  [8p SMD pad]
P11  8p SMD Pads  [8p SMD pad]
P12  8p SMD Pads  [8p SMD pad]

### Ports
Col1, Col2, Col3, Col4, Col5, Col6, Col7, Col8

### Nets
Col1: P1.1 P10.1 P11.1 P12.1 ; port Col1
Col2: P1.2 P10.2 P11.2 P12.2 ; port Col2
Col3: P1.3 P10.3 P11.3 P12.3 ; port Col3
Col4: P1.4 P10.4 P11.4 P12.4 ; port Col4
Col5: P1.5 P10.5 P11.5 P12.5 ; port Col5
Col6: P1.6 P10.6 P11.6 P12.6 ; port Col6
Col7: P1.7 P10.7 P11.7 P12.7 ; port Col7
Col8: P1.8 P10.8 P11.8 P12.8 ; port Col8

### Notes on the sheet
- Title
- Size:
- Date:
- Letter
- Number:
- Time:
- Revision:
- Sheet
- of
- Copyright 2019
- Specialized Solutions LLC
- 206 W Lincoln Hwy STE B
- New Haven, IN 46774
- www.specsolns.com <http://www.specsolns.com>
- File:

## Sheet Main Board RGB.SchDoc
size B
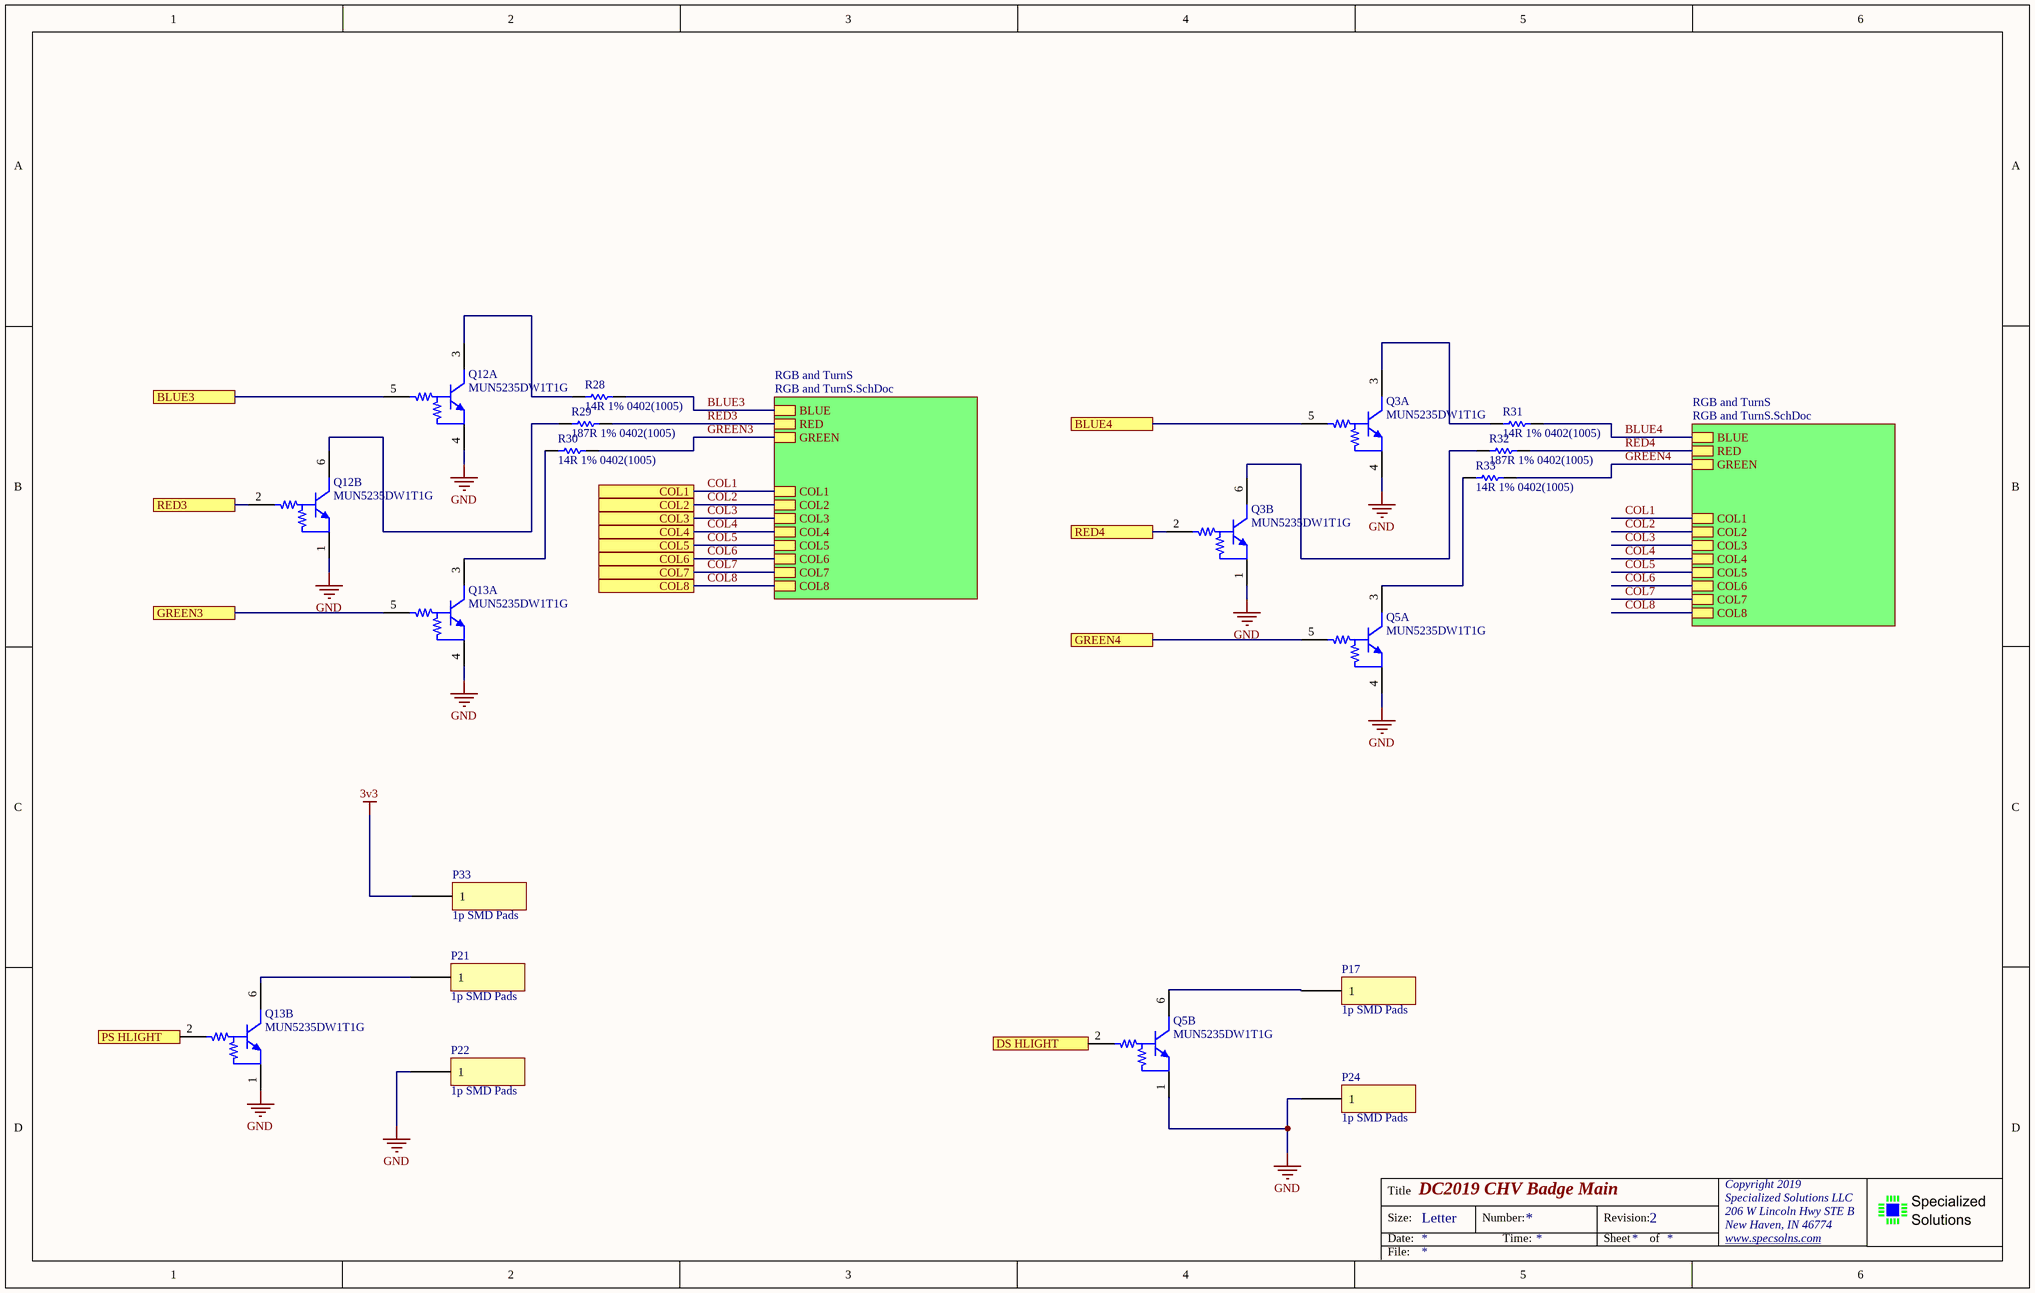
[diagram p10: Main Board RGB.SchDoc]

### Parts
P17  1p SMD Pads  [1p SMD pad]
P21  1p SMD Pads  [1p SMD pad]
P22  1p SMD Pads  [1p SMD pad]
P24  1p SMD Pads  [1p SMD pad]
P33  1p SMD Pads  [1p SMD pad]
Q3  MUN5235DW1T1G  [ONSC-SOT-363-6-419B-02_V]  (parts A,B of 2)
Q5  MUN5235DW1T1G  [ONSC-SOT-363-6-419B-02_V]  (parts A,B of 2)
Q12  MUN5235DW1T1G  [ONSC-SOT-363-6-419B-02_V]  (parts A,B of 2)
Q13  MUN5235DW1T1G  [ONSC-SOT-363-6-419B-02_V]  (parts A,B of 2)
R28  14R 1% 0402(1005)  [RESC0402(1005)_N]
R29  187R 1% 0402(1005)  [RESC0402(1005)_N]
R30  14R 1% 0402(1005)  [RESC0402(1005)_N]
R31  14R 1% 0402(1005)  [RESC0402(1005)_N]
R32  187R 1% 0402(1005)  [RESC0402(1005)_N]
R33  14R 1% 0402(1005)  [RESC0402(1005)_N]

### Sub-sheets
RGB and TurnS = RGB and TurnS.SchDoc: BLUE, RED, GREEN, COL7, COL5, COL3, COL1, COL2, COL4, COL6, COL8
RGB and TurnS = RGB and TurnS.SchDoc: BLUE, RED, GREEN, COL7, COL5, COL3, COL1, COL2, COL4, COL6, COL8

### Ports
BLUE3, BLUE4, COL1, COL2, COL3, COL4, COL5, COL6, COL7, COL8, DS HLIGHT, GREEN3, GREEN4, PS HLIGHT, RED3, RED4

### Nets
3v3: P33.1
GND: P22.1 P24.1 Q3.1(E) Q3.4(E) Q5.1(E) Q5.4(E) Q12.1(E) Q12.4(E) Q13.1(E) Q13.4(E)
BLUE3: R28.2 ; sheet RGB and TurnS/BLUE
BLUE4: R31.2 ; sheet RGB and TurnS/BLUE
Col1: port COL1, sheet RGB and TurnS/COL1, sheet RGB and TurnS/COL1
Col2: port COL2, sheet RGB and TurnS/COL2, sheet RGB and TurnS/COL2
Col3: port COL3, sheet RGB and TurnS/COL3, sheet RGB and TurnS/COL3
Col4: port COL4, sheet RGB and TurnS/COL4, sheet RGB and TurnS/COL4
Col5: port COL5, sheet RGB and TurnS/COL5, sheet RGB and TurnS/COL5
Col6: port COL6, sheet RGB and TurnS/COL6, sheet RGB and TurnS/COL6
Col7: port COL7, sheet RGB and TurnS/COL7, sheet RGB and TurnS/COL7
Col8: port COL8, sheet RGB and TurnS/COL8, sheet RGB and TurnS/COL8
GREEN3: R30.2 ; sheet RGB and TurnS/GREEN
GREEN4: R33.2 ; sheet RGB and TurnS/GREEN
RED3: R29.2 ; sheet RGB and TurnS/RED
RED4: R32.2 ; sheet RGB and TurnS/RED
NetP17_1: P17.1 Q5.6(C)
NetP21_1: P21.1 Q13.6(C)
NetQ3_2: Q3.2(B) ; port RED4
NetQ3_3: Q3.3(C) R31.1
NetQ3_5: Q3.5(B) ; port BLUE4
NetQ3_6: Q3.6(C) R32.1
NetQ5_2: Q5.2(B) ; port DS HLIGHT
NetQ5_3: Q5.3(C) R33.1
NetQ5_5: Q5.5(B) ; port GREEN4
NetQ12_2: Q12.2(B) ; port RED3
NetQ12_3: Q12.3(C) R28.1
NetQ12_5: Q12.5(B) ; port BLUE3
NetQ12_6: Q12.6(C) R29.1
NetQ13_2: Q13.2(B) ; port PS HLIGHT
NetQ13_3: Q13.3(C) R30.1
NetQ13_5: Q13.5(B) ; port GREEN3

### Notes on the sheet
- Title
- Size:
- Date:
- Letter
- Number:
- Time:
- Revision:
- Sheet
- of
- Copyright 2019
- Specialized Solutions LLC
- 206 W Lincoln Hwy STE B
- New Haven, IN 46774
- www.specsolns.com <http://www.specsolns.com>
- File:

### Library data of the parts
P17 P21 P22 P24 P33 = 1p SMD
Q3 Q5 Q12 Q13 = CMP-0630-00303-1: Dual NPN Bias Resistor Transistors, R1=2.2 kOhm, R2=47 kOhm, NPN Transistors, 6-Pin SOT-363, Pb-Free, Tape and Reel; Manufacturer: On Semiconductor; V(BR)CEO Min (V): 50; hFE Min: 80; IC Continuous (A): 0.1; R1/R2 Typ: 0.047; Packing: Tape and Reel; ComponentLink1URL: http://www.onsemi.com/; Mounting Technology: Surface Mount; ComponentLink1Description: Manufacturer URL; ComponentLink3Description: Package Specification; PackageVersion: Rev. Y, 12/2012; RoHS: TRUE; PackageDescription: 6-Pin Small Outline Transistor, Body 2 x 1.25 mm, Pitch 0.65 mm; PackageReference: SOT-363-6-419B-02; ComponentLink3URL: http://www.onsemi.cn/pub_link/Collateral/419B-02.PDF; DatasheetVersion: Rev. 0; ComponentLink2URL: http://www.onsemi.cn/pub_link/Collateral/DTC123JD-D.PDF; PartNumber: MUN5235DW1T1G; Polarity: Dual NPN; ComponentLink2Description: Datasheet; PartId: 1
R28 R30 R31 R33 = CMP-1011-00299-1: 14R 0.063W 1% 0402 (1005 Metric)  SMD; Value: 14.00 Ohm; Case-EIA: 0402; Case-Metric: 1005; Technology: SMT; Tolerance: 1 %; Power: 0.063 W
R29 R32 = CMP-1011-00426-1: 187R 0.063W 1% 0402 (1005 Metric)  SMD; Case-EIA: 0402; Value: 187.00 Ohm; Case-Metric: 1005; Technology: SMT; Tolerance: 1 %; Power: 0.063 W

## Sheet RGB and TurnS.SchDoc
size B
Used 2 times, as channels U_LED Driver/U_Main Board RGB/RGB and TurnS, U_LED Driver/U_Main Board RGB/RGB and TurnS. Parts and nets are listed once, with the designators drawn on the sheet.
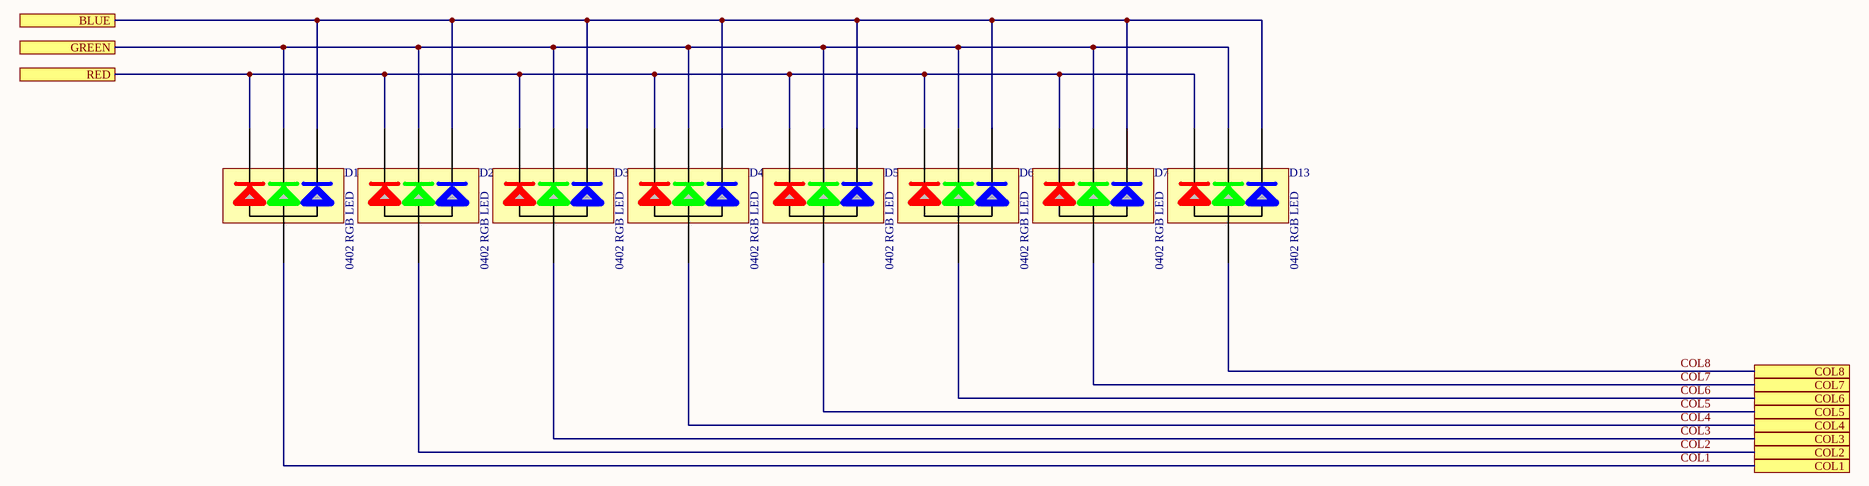
[diagram p11: RGB and TurnS.SchDoc]

### Parts
D1  0402 RGB LED  [0404 RGB LED]
D2  0402 RGB LED  [0404 RGB LED]
D3  0402 RGB LED  [0404 RGB LED]
D4  0402 RGB LED  [0404 RGB LED]
D5  0402 RGB LED  [0404 RGB LED]
D6  0402 RGB LED  [0404 RGB LED]
D7  0402 RGB LED  [0404 RGB LED]
D13  0402 RGB LED  [0404 RGB LED]

### Ports
BLUE, COL1, COL2, COL3, COL4, COL5, COL6, COL7, COL8, GREEN, RED

### Nets
BLUE: D1.4 D2.4 D3.4 D4.4 D5.4 D6.4 D7.4 D13.4 ; port BLUE
COL1: D1.1 ; port COL1
COL2: D2.1 ; port COL2
COL3: D3.1 ; port COL3
COL4: D4.1 ; port COL4
COL5: D5.1 ; port COL5
COL6: D6.1 ; port COL6
COL7: D7.1 ; port COL7
COL8: D13.1 ; port COL8
GREEN: D1.3 D2.3 D3.3 D4.3 D5.3 D6.3 D7.3 D13.3 ; port GREEN
RED: D1.2 D2.2 D3.2 D4.2 D5.2 D6.2 D7.2 D13.2 ; port RED

### Channels
U_LED Driver/U_Main Board RGB/RGB and TurnS: designators end in _U_LED_Driver_U_Main_Board_RGB_RGB_and_TurnS#1; ports BLUE=BLUE3 COL1=Col1 COL2=Col2 COL3=Col3 COL4=Col4 COL5=Col5 COL6=Col6 COL7=Col7 COL8=Col8 GREEN=GREEN3 RED=RED3
U_LED Driver/U_Main Board RGB/RGB and TurnS: designators end in _U_LED_Driver_U_Main_Board_RGB_RGB_and_TurnS#2; ports BLUE=BLUE4 COL1=Col1 COL2=Col2 COL3=Col3 COL4=Col4 COL5=Col5 COL6=Col6 COL7=Col7 COL8=Col8 GREEN=GREEN4 RED=RED4

### Notes on the sheet
- Title
- Size:
- Date:
- Letter
- Number:
- Time:
- Revision:
- Sheet
- of
- Copyright 2019
- Specialized Solutions LLC
- 206 W Lincoln Hwy STE B
- New Haven, IN 46774
- www.specsolns.com <http://www.specsolns.com>
- File:

## Sheet MK64.SchDoc
size B
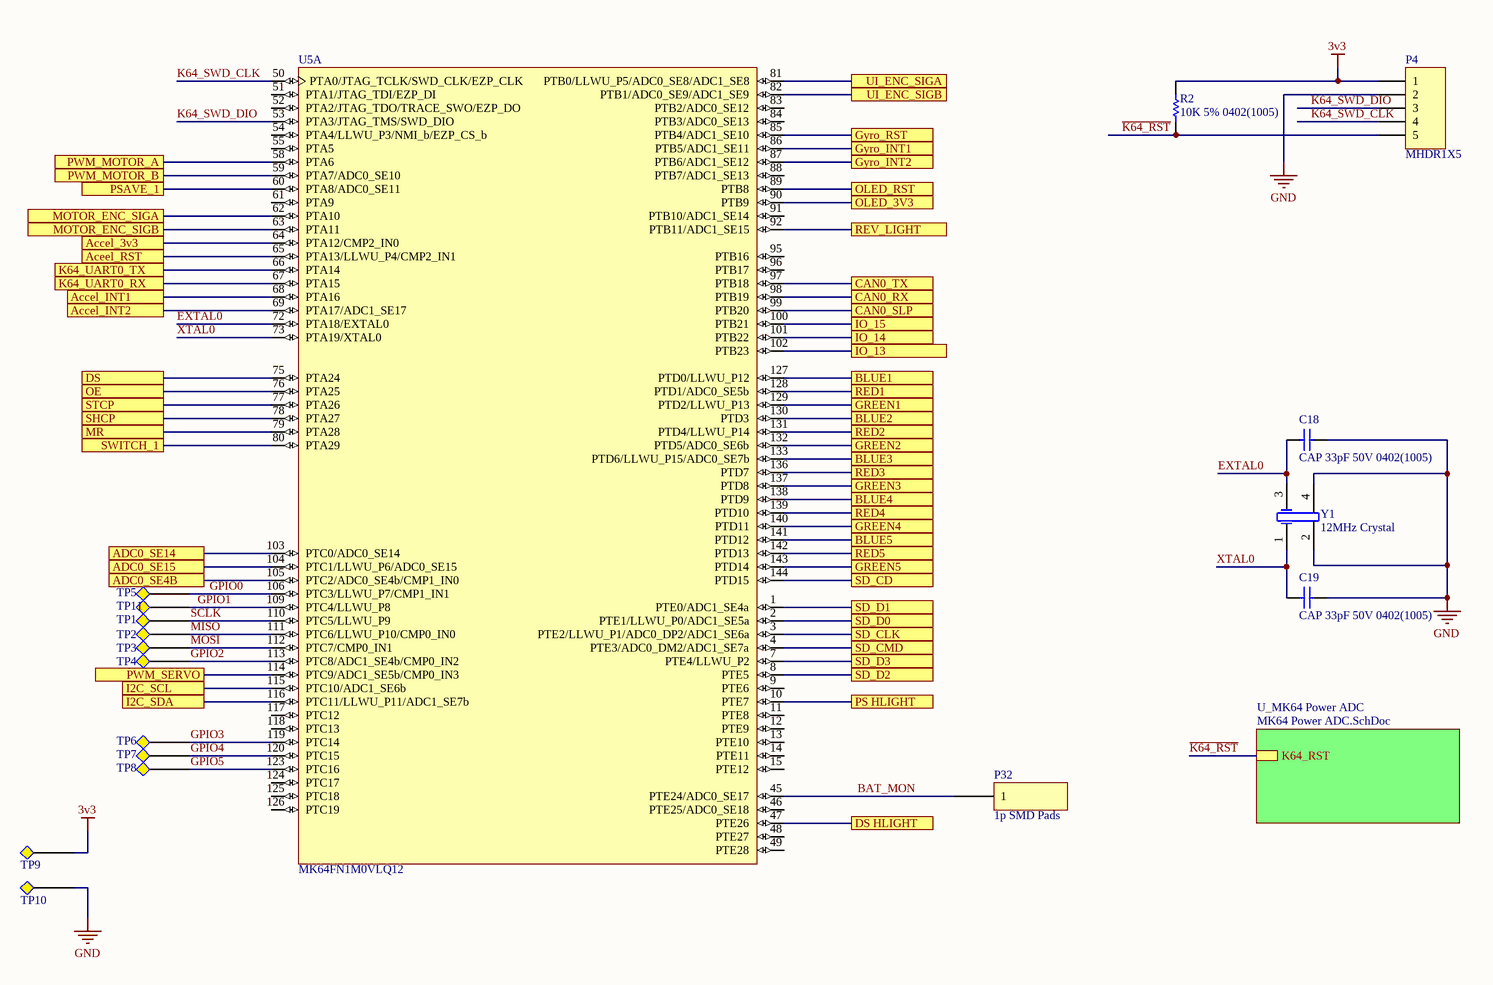
[diagram p12: MK64.SchDoc]

### Parts
C18  CAP 33pF 50V 0402(1005)  [CAPC0402(1005)60_N]
C19  CAP 33pF 50V 0402(1005)  [CAPC0402(1005)60_N]
P4  MHDR1X5  [MHDR1X5]
P32  1p SMD Pads  [1p SMD pad]
R2  10K 5% 0402(1005)  [RESC0402(1005)_N]
TP1  Test Point  [TP]  (value not drawn)  (no BOM)
TP2  Test Point  [TP]  (value not drawn)  (no BOM)
TP3  Test Point  [TP]  (value not drawn)  (no BOM)
TP4  Test Point  [TP]  (value not drawn)  (no BOM)
TP5  Test Point  [TP]  (value not drawn)  (no BOM)
TP6  Test Point  [TP]  (value not drawn)  (no BOM)
TP7  Test Point  [TP]  (value not drawn)  (no BOM)
TP8  Test Point  [TP]  (value not drawn)  (no BOM)
TP9  Test Point  [TP]  (value not drawn)  (no BOM)
TP10  Test Point  [TP]  (value not drawn)  (no BOM)
TP11  Test Point  [TP]  (value not drawn)  (no BOM)
U5  MK64FN1M0VLQ12  [918-03_N]  (part A of 3)
Y1  12MHz Crystal  [DFN155P250X80-4N]

### Sub-sheets
U_MK64 Power ADC = MK64 Power ADC.SchDoc: K64_RST

### Ports
Accel_3v3, Accel_INT1, Accel_INT2, Aceel_RST, ADC0_SE4B, ADC0_SE14, ADC0_SE15, BLUE1, BLUE2, BLUE3, BLUE4, BLUE5, CAN0_RX, CAN0_SLP, CAN0_TX, DS, DS HLIGHT, GREEN1, GREEN2, GREEN3, GREEN4, GREEN5, Gyro_INT1, Gyro_INT2, Gyro_RST, I2C_SCL, I2C_SDA, IO_13, IO_14, IO_15, K64_UART0_RX, K64_UART0_TX, MOTOR_ENC_SIGA, MOTOR_ENC_SIGB, MR, OE, OLED_3V3, OLED_RST, PS HLIGHT, PSAVE_1, PWM_MOTOR_A, PWM_MOTOR_B, PWM_SERVO, RED1, RED2, RED3, RED4, RED5, REV_LIGHT, SD_CD, SD_CLK, SD_CMD, SD_D0, SD_D1, SD_D2, SD_D3, SHCP, STCP, SWITCH_1, UI_ENC_SIGA, UI_ENC_SIGB

### Nets
3v3: P4.1 R2.2 TP9.1
GND: C18.2 C19.2 P4.2 TP10.1 Y1.2(GND) Y1.4(GND)
~{K64_RST}: P4.5 R2.1 ; sheet U_MK64 Power ADC/K64_RST
Accel_3v3: U5.64(PTA12/CMP2_IN0) ; port Accel_3v3
BAT_MON: P32.1 U5.45(PTE24/ADC0_SE17)
EXTAL0: C18.1 U5.72(PTA18/EXTAL0) Y1.3(OSC2)
GPIO0: TP5.1 U5.106(PTC3/LLWU_P7/CMP1_IN1)
GPIO1: TP11.1 U5.109(PTC4/LLWU_P8)
GPIO2: TP4.1 U5.113(PTC8/ADC1_SE4b/CMP0_IN2)
GPIO3: TP6.1 U5.119(PTC14)
GPIO4: TP7.1 U5.120(PTC15)
GPIO5: TP8.1 U5.123(PTC16)
INT1: U5.68(PTA16) ; port Accel_INT1
INT2: U5.69(PTA17/ADC1_SE17) ; port Accel_INT2
K64_SWD_CLK: P4.4 U5.50(PTA0/JTAG_TCLK/SWD_CLK/EZP_CLK)
K64_SWD_DIO: P4.3 U5.53(PTA3/JTAG_TMS/SWD_DIO)
MISO: TP2.1 U5.111(PTC6/LLWU_P10/CMP0_IN0)
MOSI: TP3.1 U5.112(PTC7/CMP0_IN1)
OLED_3V3: U5.90(PTB9) ; port OLED_3V3
RST: U5.65(PTA13/LLWU_P4/CMP2_IN1) ; port Aceel_RST
SCL: U5.115(PTC10/ADC1_SE6b) ; port I2C_SCL
SCLK: TP1.1 U5.110(PTC5/LLWU_P9)
SDA: U5.116(PTC11/LLWU_P11/ADC1_SE7b) ; port I2C_SDA
SW1: U5.80(PTA29) ; port SWITCH_1
UI_ENC_SIGA: U5.81(PTB0/LLWU_P5/ADC0_SE8/ADC1_SE8) ; port UI_ENC_SIGA
UI_ENC_SIGB: U5.82(PTB1/ADC0_SE9/ADC1_SE9) ; port UI_ENC_SIGB
XTAL0: C19.1 U5.73(PTA19/XTAL0) Y1.1(OSC1)
NetC3_2: U5.104(PTC1/LLWU_P6/ADC0_SE15) ; port ADC0_SE15
NetC4_2: U5.103(PTC0/ADC0_SE14) ; port ADC0_SE14
NetC5_2: U5.105(PTC2/ADC0_SE4b/CMP1_IN0) ; port ADC0_SE4B
NetP7_1: U5.8(PTE5) ; port SD_D2
NetP7_2: U5.7(PTE4/LLWU_P2) ; port SD_D3
NetP7_3: U5.4(PTE3/ADC0_DM2/ADC1_SE7a) ; port SD_CMD
NetP7_7: U5.2(PTE1/LLWU_P0/ADC1_SE5a) ; port SD_D0
NetP7_8: U5.1(PTE0/ADC1_SE4a) ; port SD_D1
NetP7_9: U5.144(PTD15) ; port SD_CD
NetQ2_2: U5.128(PTD1/ADC0_SE5b) ; port RED1
NetQ2_5: U5.127(PTD0/LLWU_P12) ; port BLUE1
NetQ3_2: U5.139(PTD10) ; port RED4
NetQ3_5: U5.138(PTD9) ; port BLUE4
NetQ4_2: U5.142(PTD13) ; port RED5
NetQ4_5: U5.129(PTD2/LLWU_P13) ; port GREEN1
NetQ5_2: U5.47(PTE26) ; port DS HLIGHT
NetQ5_5: U5.140(PTD11) ; port GREEN4
NetQ10_2: U5.92(PTB11/ADC1_SE15) ; port REV_LIGHT
NetQ10_5: U5.143(PTD14) ; port GREEN5
NetQ11_2: U5.132(PTD5/ADC0_SE6b) ; port GREEN2
NetQ11_5: U5.131(PTD4/LLWU_P14) ; port RED2
NetQ12_2: U5.136(PTD7) ; port RED3
NetQ12_5: U5.133(PTD6/LLWU_P15/ADC0_SE7b) ; port BLUE3
NetQ13_2: U5.10(PTE7) ; port PS HLIGHT
NetQ13_5: U5.137(PTD8) ; port GREEN3
NetQ14_2: U5.141(PTD12) ; port BLUE5
NetQ14_5: U5.130(PTD3) ; port BLUE2
NetR13_1: U5.3(PTE2/LLWU_P1/ADC0_DP2/ADC1_SE6a) ; port SD_CLK
NetSW1_1: U5.63(PTA11) ; port MOTOR_ENC_SIGB
NetSW1_2: U5.62(PTA10) ; port MOTOR_ENC_SIGA
NetU1_10: U5.79(PTA28) ; port MR
NetU1_11: U5.78(PTA27) ; port SHCP
NetU1_12: U5.77(PTA26) ; port STCP
NetU1_13: U5.76(PTA25) ; port OE
NetU1_14: U5.75(PTA24) ; port DS
NetU2_1: U5.58(PTA6) ; port PWM_MOTOR_A
NetU2_2: U5.59(PTA7/ADC0_SE10) ; port PWM_MOTOR_B
NetU2_12: U5.114(PTC9/ADC1_SE5b/CMP0_IN3) ; port PWM_SERVO
NetU2_13: U5.60(PTA8/ADC0_SE11) ; port PSAVE_1
NetU3_3: U5.100(PTB21) ; port IO_15
NetU3_4: U5.101(PTB22) ; port IO_14
NetU3_5: U5.102(PTB23) ; port IO_13
NetU4_46: U5.66(PTA14) ; port K64_UART0_TX
NetU4_47: U5.67(PTA15) ; port K64_UART0_RX
NetU5_85: U5.85(PTB4/ADC1_SE10) ; port Gyro_RST
NetU5_86: U5.86(PTB5/ADC1_SE11) ; port Gyro_INT1
NetU5_87: U5.87(PTB6/ADC1_SE12) ; port Gyro_INT2
NetU5_89: U5.89(PTB8) ; port OLED_RST
NetU5_97: U5.97(PTB18) ; port CAN0_TX
NetU5_98: U5.98(PTB19) ; port CAN0_RX
NetU5_99: U5.99(PTB20) ; port CAN0_SLP

Not connected (* = marked no-connect by the designer): U5 9(PTE6) 11(PTE8) 12(PTE9) 13(PTE10) 14(PTE11) 15(PTE12) 46(PTE25/ADC0_SE18) 48(PTE27) 49(PTE28) 51(PTA1/JTAG_TDI/EZP_DI) 52(PTA2/JTAG_TDO/TRACE_SWO/EZP_DO) 54(PTA4/LLWU_P3/NMI_b/EZP_CS_b) 55(PTA5) 61(PTA9) 83(PTB2/ADC0_SE12) 84(PTB3/ADC0_SE13) 88(PTB7/ADC1_SE13) 91(PTB10/ADC1_SE14) 95(PTB16) 96(PTB17) 117(PTC12) 118(PTC13) 124(PTC17) 125(PTC18) 126(PTC19)

### Notes on the sheet
- Title
- Size:
- Date:
- Letter
- Number:
- Time:
- Revision:
- Sheet
- of
- Copyright 2019
- Specialized Solutions LLC
- 206 W Lincoln Hwy STE B
- New Haven, IN 46774
- www.specsolns.com <http://www.specsolns.com>
- File:

### Library data of the parts
C18 C19 = CMP-1034-01004-1: as C11 on sheet Bluetooth; Rated Voltage: 50 V; Value: 33pF; Technology: SMT; Max Thickness: 0.6 mm
P4 = MHDR1X5: Header, 5-Pin; LatestRevisionDate: 17-Jul-2002; LatestRevisionNote: Re-released for DXP Platform.; Publisher: Altium Limited
P32 = 1p SMD
R2 = CMP-1011-00098-1: as R7 on sheet SDCard; Technology: SMT; Tolerance: 5 %; Power: 0.063 W
TP1-TP11 = TP
U5 = CMP-0182-00046-1: Cortex-M4-based Microcontroller with FPU, 1 MB, 120 MHz, 1.71 to 3.6 V, -40 to 105 degC, 144-Pin QFP (918-03), RoHS, Tray; Manufacturer: Freescale Semiconductor; SRAM: 256 KB; Flash: 1 MB; ComponentLink2URL: http://cache.freescale.com/files/microcontrollers/doc/data_sheet/K64P144M120SF5.pdf?pspll=1; VDD: 1.71 to 3.6 V; PackageDescription: 144-Pin Plastic Quad Flat Package, Body 20 x 20 mm, Pitch 0.5 mm; Temperature Range: -40 to 105 degC; ComponentLink1URL: http://www.freescale.com/; ComponentLink3Description: Package Specification; PartNumber: MK64FN1M0VLQ12; VBAT: 1.71 to 3.6 V; ComponentLink1Description: Manufacturer URL; ComponentLink3URL: http://cache.freescale.com/files/shared/doc/package_info/98ASS23177W.pdf; DatasheetVersion: Rev. 3; PackageVersion: Rev. G; RoHS: TRUE; Mounting Technology: Surface Mount; Packing: Tray; VDDA: 1.71 to 3.6 V; ComponentLink2Description: Datasheet; PartId: 1
Y1 = 403C11E16M00000: CRYSTAL 12.0000MHZ 20PF SMD 3.20x2.50; Published: 8-Jun-2000; LatestRevisionDate: 17-Jul-2002; LatestRevisionNote: Re-released for DXP Platform.; PackageReference: R38; Publisher: Altium Limited; PackageDescription: Crystal, Thru-Hole; 2 Leads; Body 3.1 x 8.2 mm (Dia.xH)

## Sheet MK64 Power ADC.SchDoc
size Letter
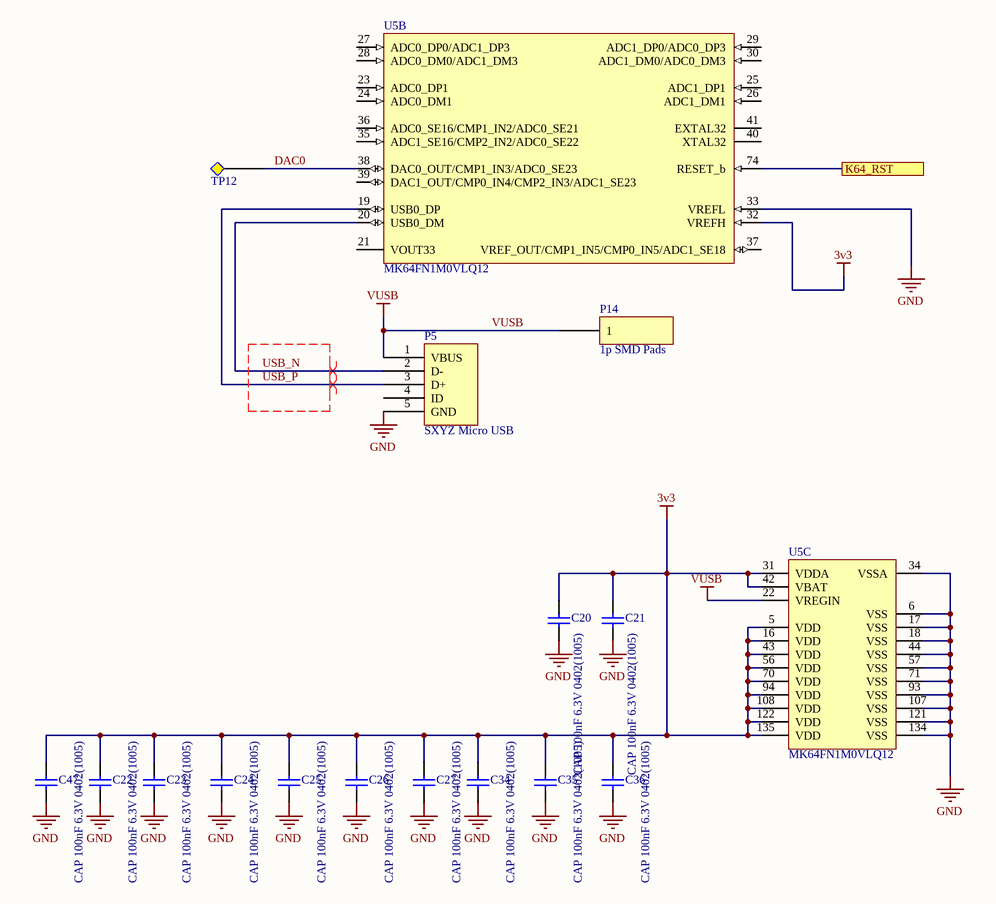
[diagram p13: MK64 Power ADC.SchDoc]

### Parts
C20  CAP 100nF 6.3V 0402(1005)  [CAPC0402(1005)60_M]
C21  CAP 100nF 6.3V 0402(1005)  [CAPC0402(1005)60_M]
C22  CAP 100nF 6.3V 0402(1005)  [CAPC0402(1005)60_M]
C23  CAP 100nF 6.3V 0402(1005)  [CAPC0402(1005)60_M]
C24  CAP 100nF 6.3V 0402(1005)  [CAPC0402(1005)60_M]
C25  CAP 100nF 6.3V 0402(1005)  [CAPC0402(1005)60_M]
C26  CAP 100nF 6.3V 0402(1005)  [CAPC0402(1005)60_M]
C27  CAP 100nF 6.3V 0402(1005)  [CAPC0402(1005)60_M]
C34  CAP 100nF 6.3V 0402(1005)  [CAPC0402(1005)60_M]
C35  CAP 100nF 6.3V 0402(1005)  [CAPC0402(1005)60_M]
C36  CAP 100nF 6.3V 0402(1005)  [CAPC0402(1005)60_M]
C47  CAP 100nF 6.3V 0402(1005)  [CAPC0402(1005)60_M]
P5  SXYZ Micro USB  [SXYZ Micro USB]
P14  1p SMD Pads  [1p SMD pad]
TP12  Test Point  [TP]  (value not drawn)  (no BOM)
U5  MK64FN1M0VLQ12  [918-03_N]  (parts B,C of 3)

### Ports
K64_RST

### Nets
3v3: C20.2 C21.2 C22.2 C23.2 C24.2 C25.2 C26.2 C27.2 C34.2 C35.2 C36.2 C47.2 U5.5(VDD) U5.16(VDD) U5.31(VDDA) U5.32(VREFH) U5.42(VBAT) U5.43(VDD) U5.56(VDD) U5.70(VDD) U5.94(VDD) U5.108(VDD) U5.122(VDD) U5.135(VDD)
GND: C20.1 C21.1 C22.1 C23.1 C24.1 C25.1 C26.1 C27.1 C34.1 C35.1 C36.1 C47.1 P5.5(GND) U5.6(VSS) U5.17(VSS) U5.18(VSS) U5.33(VREFL) U5.34(VSSA) U5.44(VSS) U5.57(VSS) U5.71(VSS) U5.93(VSS) U5.107(VSS) U5.121(VSS) U5.134(VSS)
VUSB: P5.1(VBUS) P14.1 U5.22(VREGIN)
~{K64_RST}: U5.74(RESET_b) ; port K64_RST
DAC0: TP12.1 U5.38(DAC0_OUT/CMP1_IN3/ADC0_SE23)
USB_N: P5.2(D-) U5.20(USB0_DM)
USB_P: P5.3(D+) U5.19(USB0_DP)

Not connected (* = marked no-connect by the designer): P5 4(ID); U5 21(VOUT33) 23(ADC0_DP1) 24(ADC0_DM1) 25(ADC1_DP1) 26(ADC1_DM1) 27(ADC0_DP0/ADC1_DP3) 28(ADC0_DM0/ADC1_DM3) 29(ADC1_DP0/ADC0_DP3) 30(ADC1_DM0/ADC0_DM3) 35(ADC1_SE16/CMP2_IN2/ADC0_SE22) 36(ADC0_SE16/CMP1_IN2/ADC0_SE21) 37(VREF_OUT/CMP1_IN5/CMP0_IN5/ADC1_SE18) 39(DAC1_OUT/CMP0_IN4/CMP2_IN3/ADC1_SE23) 40(XTAL32) 41(EXTAL32)

### Layout directives
differential pair: USB_N, USB_P

### Notes on the sheet
- Title
- Size:
- Date:
- Letter
- Number:
- Time:
- Revision:
- Sheet
- of
- Copyright 2019
- Specialized Solutions LLC
- 206 W Lincoln Hwy STE B
- New Haven, IN 46774
- www.specsolns.com <http://www.specsolns.com>
- File:

### Library data of the parts
C20-C27 C34-C36 C47 = CMP-1034-02062-1: as C28 on sheet Gyro; Value: 100nF; Technology: SMT; Max Thickness: 0.6 mm; Rated Voltage: 6.3 V
P5 = SXYZ MicroUSB: Micro USB Connector
P14 = 1p SMD
TP12 = TP
U5 = CMP-0182-00046-1: as U5 on sheet MK64; ComponentLink2URL: http://cache.freescale.com/files/microcontrollers/doc/data_sheet/K64P144M120SF5.pdf?pspll=1; VDD: 1.71 to 3.6 V; PackageDescription: 144-Pin Plastic Quad Flat Package, Body 20 x 20 mm, Pitch 0.5 mm; Temperature Range: -40 to 105 degC; ComponentLink1URL: http://www.freescale.com/; ComponentLink3Description: Package Specification; PartNumber: MK64FN1M0VLQ12; VBAT: 1.71 to 3.6 V; ComponentLink1Description: Manufacturer URL; ComponentLink3URL: http://cache.freescale.com/files/shared/doc/package_info/98ASS23177W.pdf; DatasheetVersion: Rev. 3; PackageVersion: Rev. G; RoHS: TRUE; Mounting Technology: Surface Mount; Packing: Tray; VDDA: 1.71 to 3.6 V; ComponentLink2Description: Datasheet; PartId: 2

## Sheet Accel.SchDoc
size Letter
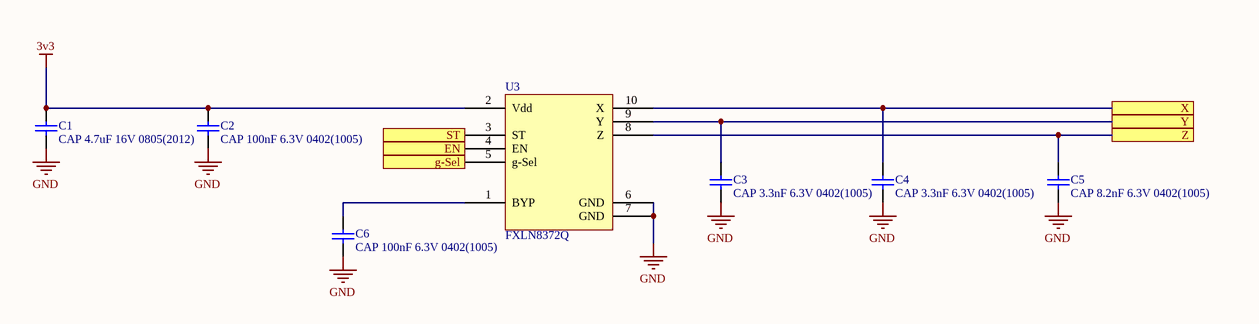
[diagram p14: Accel.SchDoc]

### Parts
C1  CAP 4.7uF 16V 0805(2012)  [CAPC0805(2012)155_M]
C2  CAP 100nF 6.3V 0402(1005)  [CAPC0402(1005)60_M]
C3  CAP 3.3nF 6.3V 0402(1005)  [CAPC0402(1005)60_M]
C4  CAP 3.3nF 6.3V 0402(1005)  [CAPC0402(1005)60_M]
C5  CAP 8.2nF 6.3V 0402(1005)  [CAPC0402(1005)60_L]
C6  CAP 100nF 6.3V 0402(1005)  [CAPC0402(1005)60_M]
U3  FXLN8372Q  [QFN65P300X300X100-12N]

### Ports
EN, g-Sel, ST, X, Y, Z

### Nets
3v3: C1.2 C2.2 U3.2(Vdd)
GND: C1.1 C2.1 C3.1 C4.1 C5.1 C6.1 U3.6(GND) U3.7(GND)
NetC3_2: C3.2 U3.9(Y) ; port Y
NetC4_2: C4.2 U3.10(X) ; port X
NetC5_2: C5.2 U3.8(Z) ; port Z
NetC6_2: C6.2 U3.1(BYP)
NetU3_3: U3.3(ST) ; port ST
NetU3_4: U3.4(EN) ; port EN
NetU3_5: U3.5(g-Sel) ; port g-Sel

### Notes on the sheet
- Title
- Size:
- Date:
- Letter
- Number:
- Time:
- Revision:
- Sheet
- of
- Copyright 2019
- Specialized Solutions LLC
- 206 W Lincoln Hwy STE B
- New Haven, IN 46774
- www.specsolns.com <http://www.specsolns.com>
- File:

### Library data of the parts
C1 = CMP-1036-04892-1: CAP 4.7uF 16V ±20% 0805 (2012 Metric) Thickness 1.55mm SMD; Case-EIA: 0805; Tolerance: Â±20%; Case-Metric: 2012; Rated Voltage: 16 V; Value: 4.7uF; Max Thickness: 1.55 mm; Technology: SMT
C2 C6 = CMP-1034-02062-1: as C28 on sheet Gyro; Value: 100nF; Technology: SMT; Max Thickness: 0.6 mm; Rated Voltage: 6.3 V
C3 C4 = CMP-1034-01767-1: CAP 3.3nF 6.3V ±20% 0402 (1005 Metric) Thickness 0.6mm SMD; Case-EIA: 0402; Tolerance: Â±20%; Case-Metric: 1005; Rated Voltage: 6.3 V; Value: 3.3nF; Technology: SMT; Max Thickness: 0.6 mm
C5 = CMP-1034-01854-1: CAP 8.2nF 6.3V ±20% 0402 (1005 Metric) Thickness 0.6mm SMD; Tolerance: Â±20%; Case-Metric: 1005; Case-EIA: 0402; Value: 8.2nF; Technology: SMT; Rated Voltage: 6.3 V; Max Thickness: 0.6 mm
U3 = FXLN8372Q: Xtrinsic FXLN83xxQ 3-Axis Low-Power Analog-Output Accelerometer

## Sheet Switch and Encoder.SchDoc
size Letter
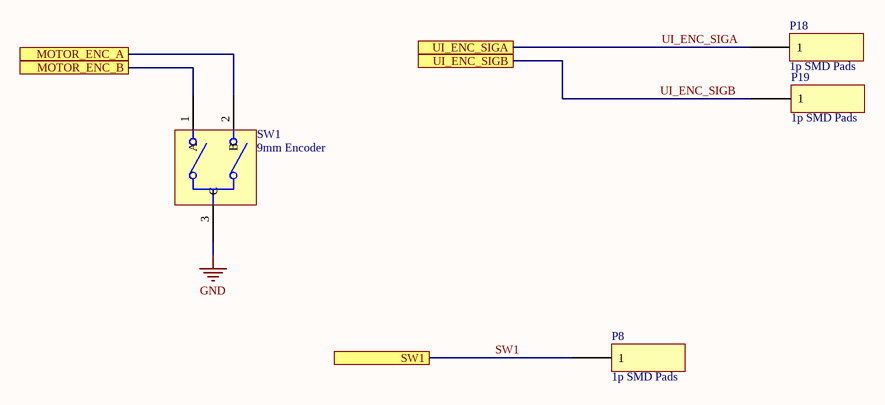
[diagram p15: Switch and Encoder.SchDoc]

### Parts
P8  1p SMD Pads  [1p SMD pad]
P18  1p SMD Pads  [1p SMD pad]
P19  1p SMD Pads  [1p SMD pad]
SW1  9mm Encoder  [9mm encoder]

### Ports
MOTOR_ENC_A, MOTOR_ENC_B, SW1, UI_ENC_SIGA, UI_ENC_SIGB

### Nets
GND: SW1.3(C)
SW1: P8.1 ; port SW1
UI_ENC_SIGA: P18.1 ; port UI_ENC_SIGA
UI_ENC_SIGB: P19.1 ; port UI_ENC_SIGB
NetSW1_1: SW1.1(A) ; port MOTOR_ENC_B
NetSW1_2: SW1.2(B) ; port MOTOR_ENC_A

### Notes on the sheet
- Title
- Size:
- Date:
- Letter
- Number:
- Time:
- Revision:
- Sheet
- of
- Copyright 2019
- Specialized Solutions LLC
- 206 W Lincoln Hwy STE B
- New Haven, IN 46774
- www.specsolns.com <http://www.specsolns.com>
- File:

### Library data of the parts
P8 P18 P19 = 1p SMD

## Sheet Power.SchDoc
size Letter
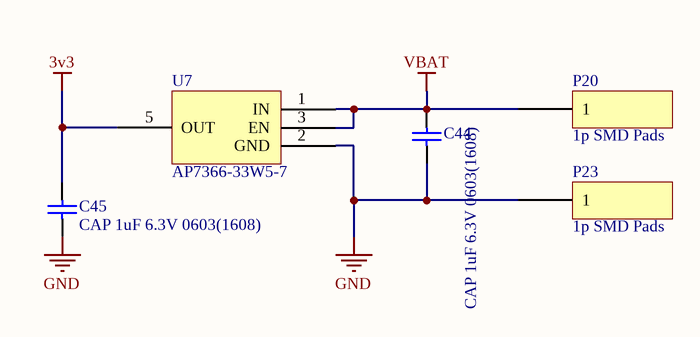
[diagram p16: Power.SchDoc]

### Parts
C44  CAP 1uF 6.3V 0603(1608)  [CAPC0603(1608)100_L]
C45  CAP 1uF 6.3V 0603(1608)  [CAPC0603(1608)100_L]
P20  1p SMD Pads  [1p SMD pad]
P23  1p SMD Pads  [1p SMD pad]
U7  AP7366-33W5-7  [SOT95P280X145-5N]

### Nets
3v3: C45.2 U7.5(OUT)
GND: C44.1 C45.1 P23.1 U7.2(GND)
VBAT: C44.2 P20.1 U7.1(IN) U7.3(EN)

### Notes on the sheet
- Title
- Size:
- Date:
- Letter
- Number:
- Time:
- Revision:
- Sheet
- of
- Copyright 2019
- Specialized Solutions LLC
- 206 W Lincoln Hwy STE B
- New Haven, IN 46774
- www.specsolns.com <http://www.specsolns.com>
- File:

### Library data of the parts
C44 C45 = CMP-1035-02731-1: as C39 on sheet OLED; Value: 1uF; Technology: SMT; Max Thickness: 1 mm; Rated Voltage: 6.3 V
P20 P23 = 1p SMD
U7 = AP7366-33W5-7: Linear Voltage Regulator IC 1 Output 600mA SOT-25